# EasyEDA Pro project mt7621_integrated_router_v2.6_2025-04-17.epro, board PCB1
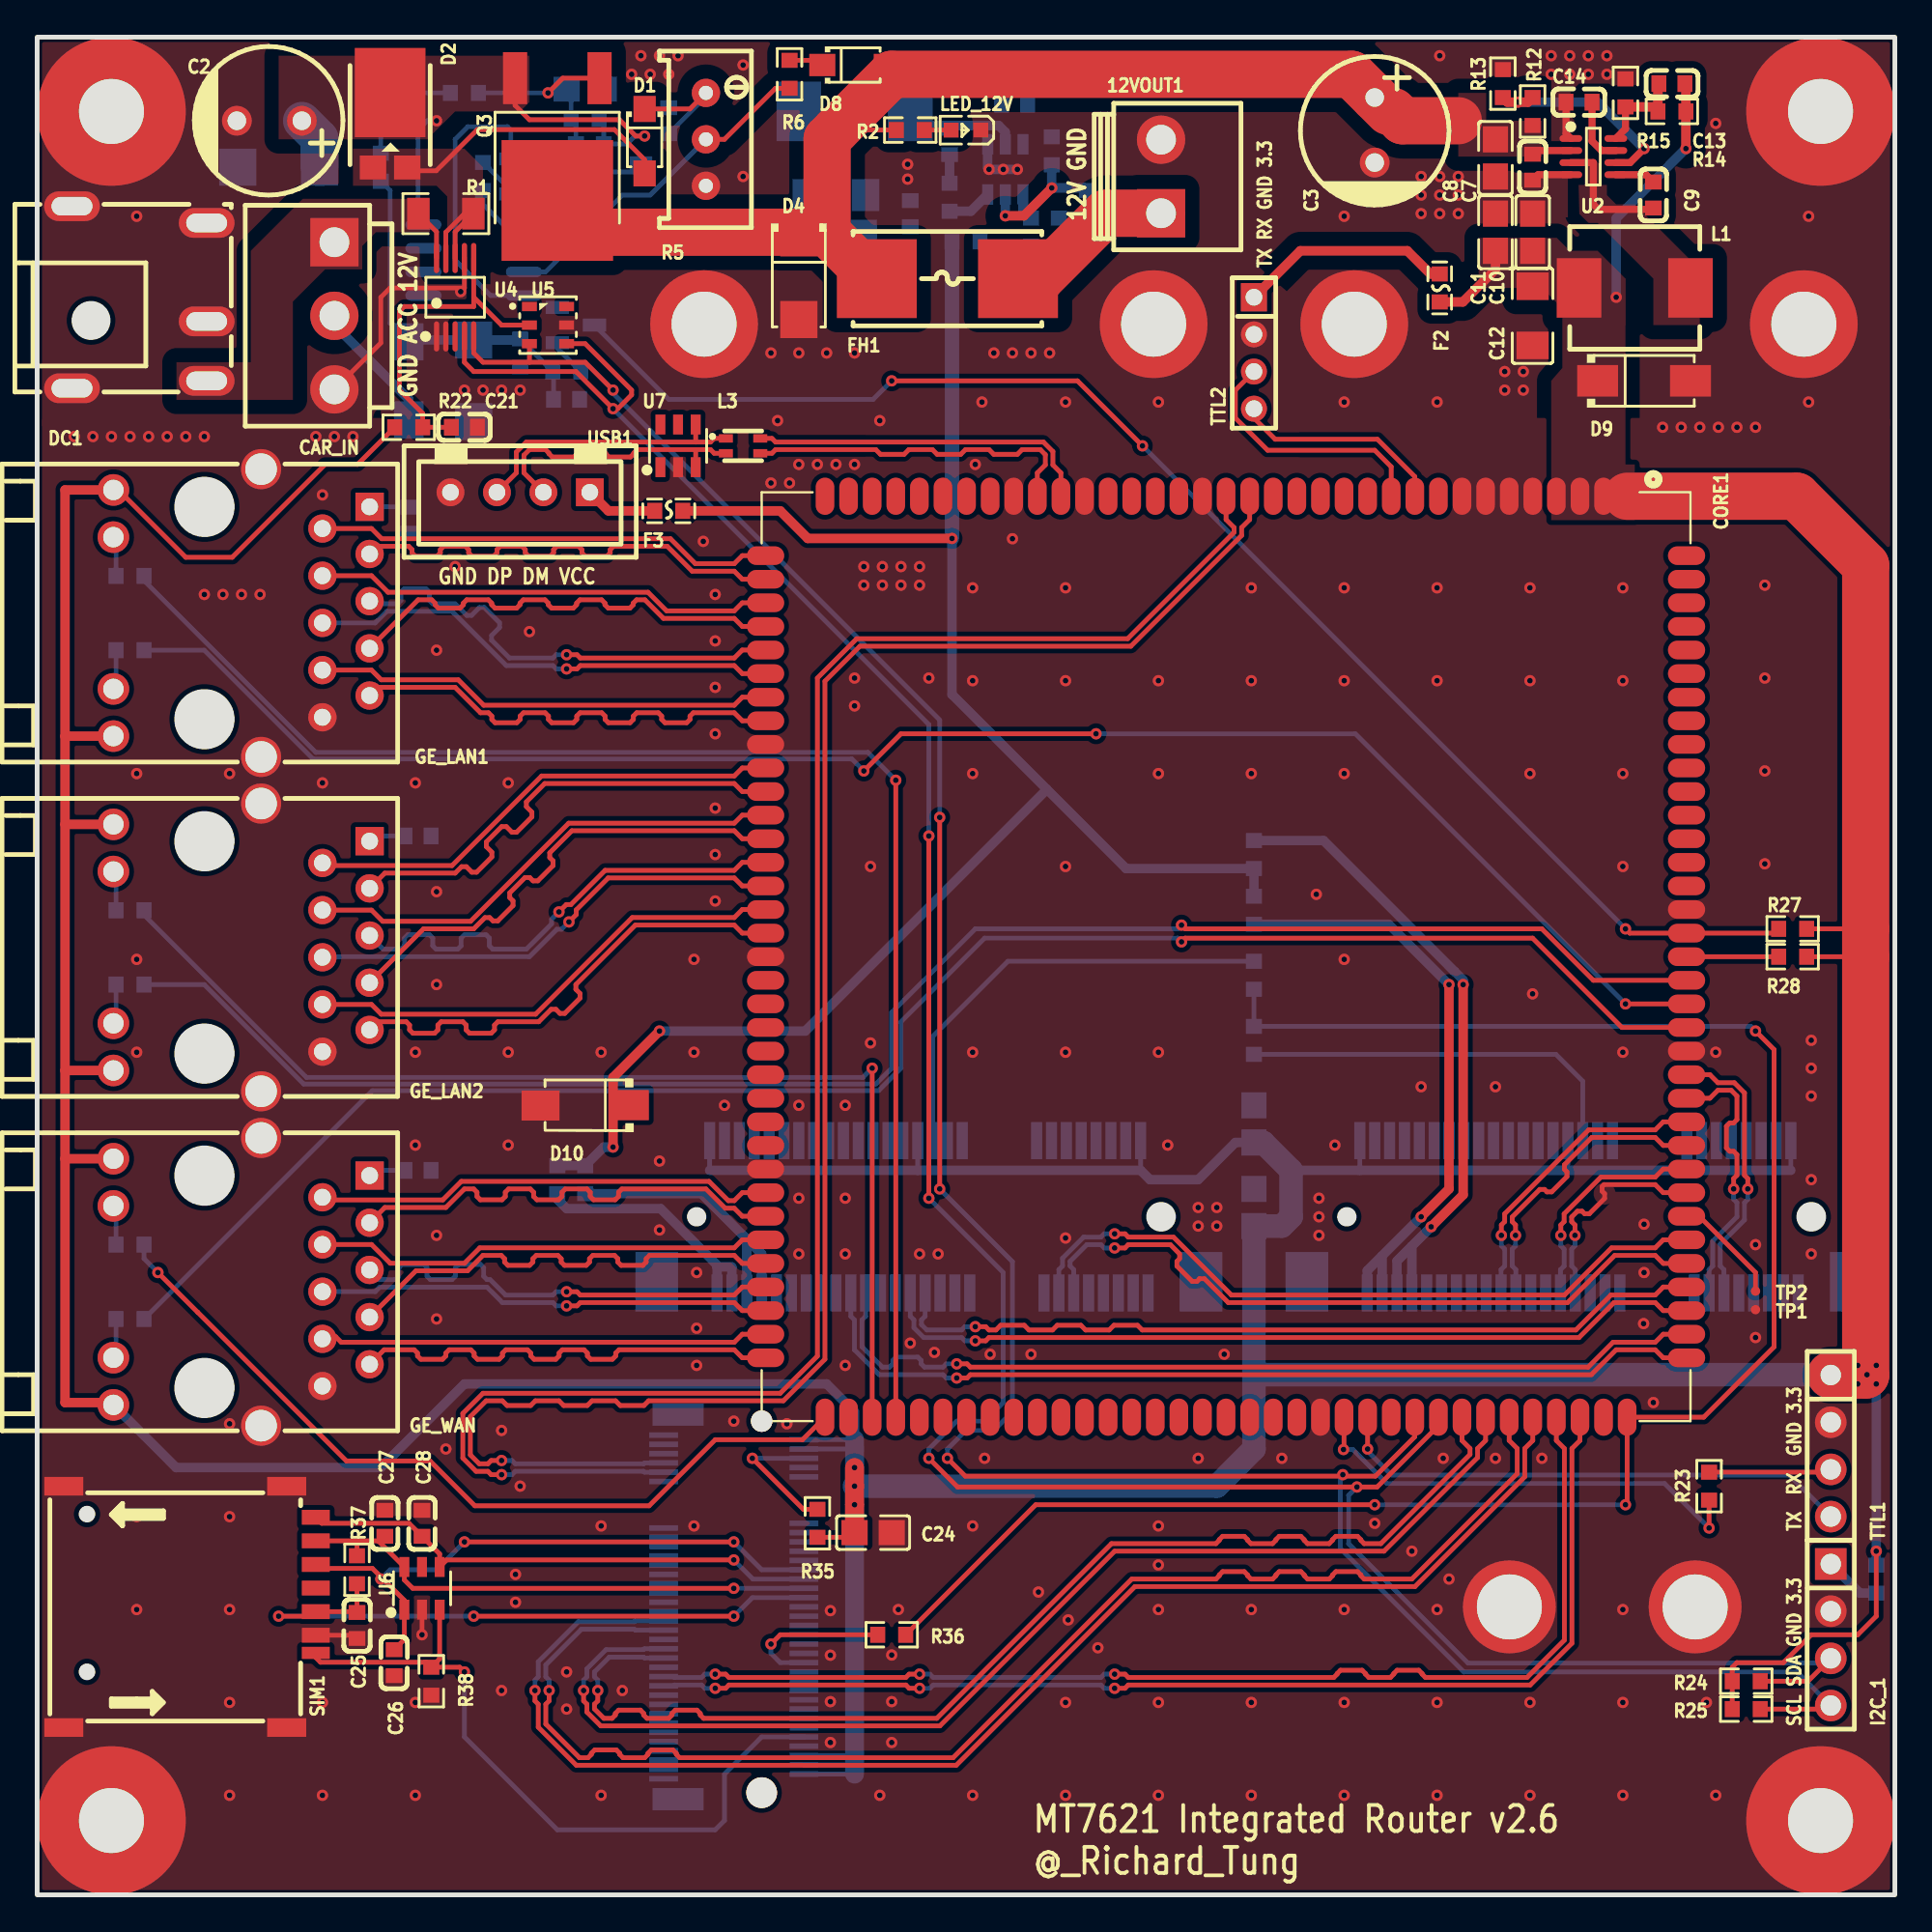
[diagram p5: board, top side]
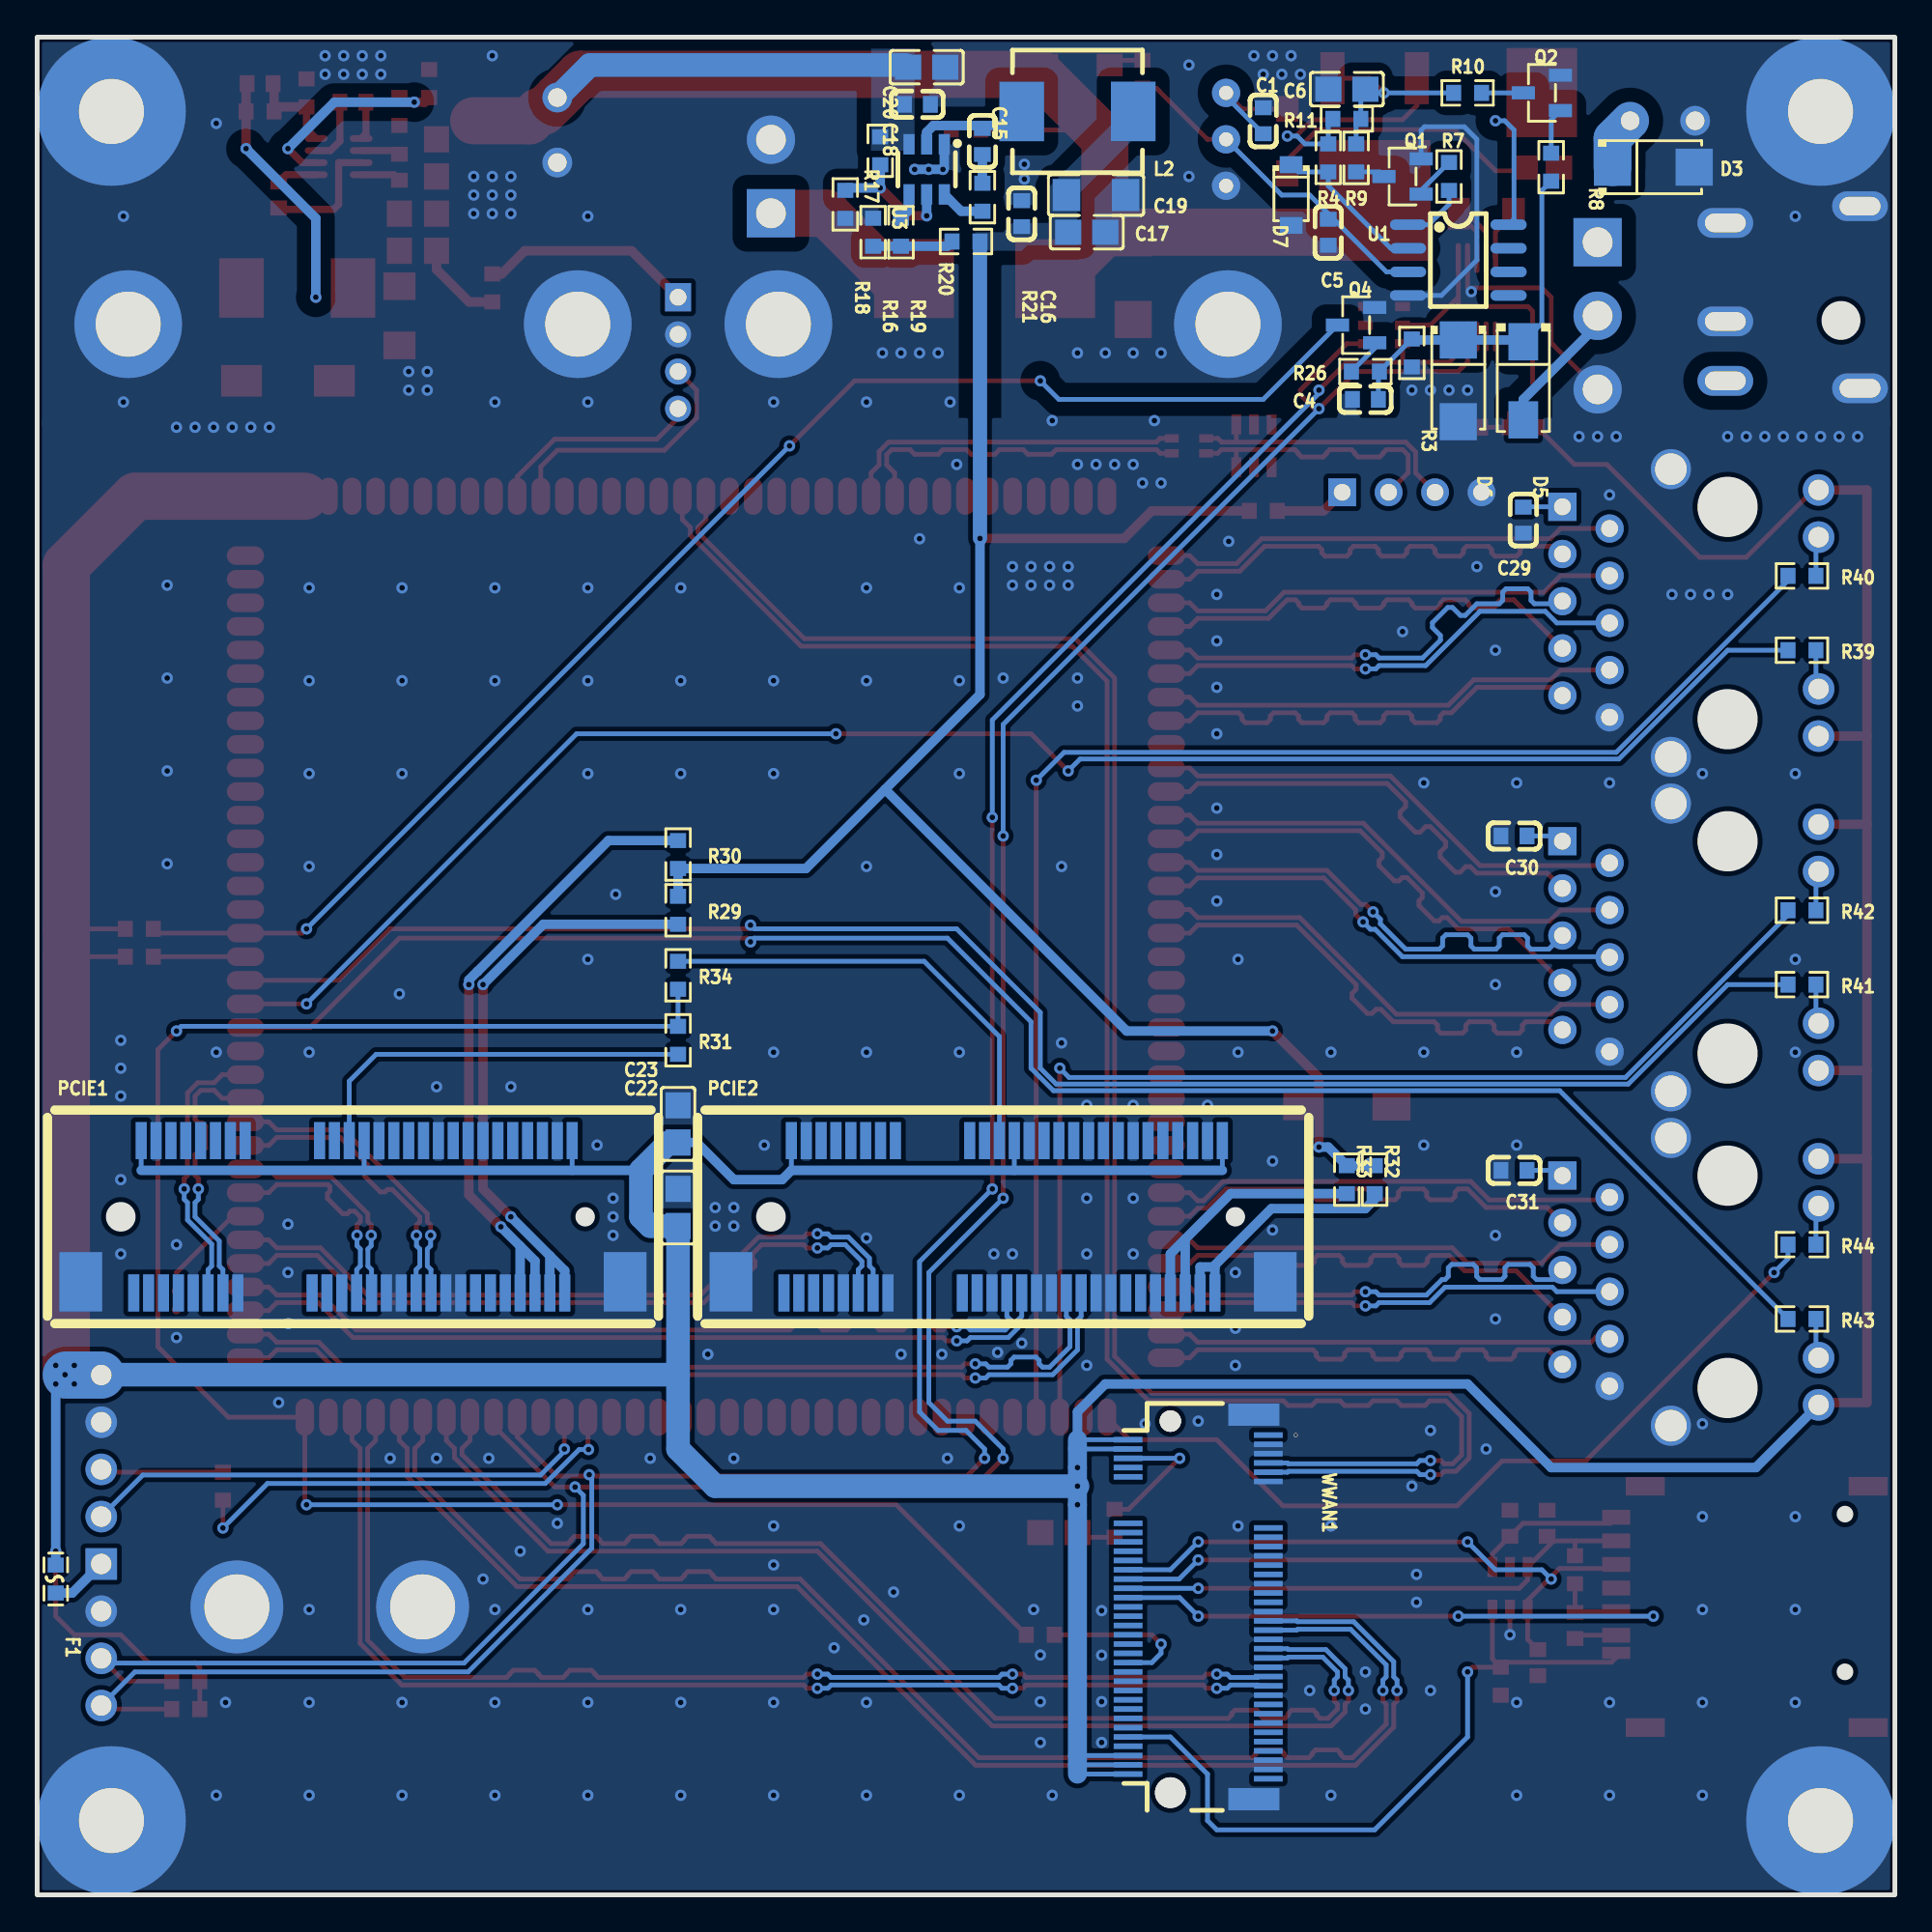
[diagram p6: board, bottom side, seen from below]

Outline 100 x 100 mm; copper layers: Top Layer, Bottom Layer. Coordinates in mm from the lower left corner of the outline.
Outline path: rectangle 0,100 100,0
Stack: Top Layer 0.035mm / Dielectric1 1.51mm FR4 er 4.5 / Bottom Layer 0.035mm

## Design rules (mm)
net USB_LTE_DP: DP1
net USB_LTE_DM: DP1
net ESW_P0_A_TXV+: ESW_P0_A_TXV
net ESW_P0_A_TXV-: ESW_P0_A_TXV
net ESW_P0_B_TXV+: ESW_P0_B_TXV
net ESW_P0_B_TXV-: ESW_P0_B_TXV
net ESW_P0_C_TXV+: ESW_P0_C_TXV
net ESW_P0_C_TXV-: ESW_P0_C_TXV
net ESW_P0_D_TXV+: ESW_P0_D_TXV
net ESW_P0_D_TXV-: ESW_P0_D_TXV
net ESW_P1_A_TXV+: ESW_P1_A_TXV
net ESW_P1_A_TXV-: ESW_P1_A_TXV
net ESW_P1_B_TXV+: ESW_P1_B_TXV
net ESW_P1_B_TXV-: ESW_P1_B_TXV
net ESW_P1_C_TXV+: ESW_P1_C_TXV
net ESW_P1_C_TXV-: ESW_P1_C_TXV
net ESW_P1_D_TXV+: ESW_P1_D_TXV
net ESW_P1_D_TXV-: ESW_P1_D_TXV
net PCIE2_TX-: PCIE2_TX
net PCIE2_TX+: PCIE2_TX
net PCIE2_RX-: PCIE2_RX
net PCIE2_RX+: PCIE2_RX
net PCIE2_REFCLK-: PCIE2_REFCLK
net PCIE2_REFCLK+: PCIE2_REFCLK
net PCIE1_TX+: PCIE1_TX
net PCIE1_TX-: PCIE1_TX
net PCIE1_RX+: PCIE1_RX
net PCIE1_RX-: PCIE1_RX
net PCIE1_REFCLK-: PCIE1_REFCLK
net PCIE1_REFCLK+: PCIE1_REFCLK
net PCIE0_RX+: PCIE0_RX
net PCIE0_RX-: PCIE0_RX
net PCIE0_TX-: PCIE0_TX
net PCIE0_TX+: PCIE0_TX
net PCIE0_REFCLK+: PCIE0_REFCLK
net PCIE0_REFCLK-: PCIE0_REFCLK
net ESW_P4_A_TXV+: ESW_P4_A_TXV
net ESW_P4_A_TXV-: ESW_P4_A_TXV
net ESW_P4_B_TXV+: ESW_P4_B_TXV
net ESW_P4_B_TXV-: ESW_P4_B_TXV
net ESW_P4_C_TXV+: ESW_P4_C_TXV
net ESW_P4_C_TXV-: ESW_P4_C_TXV
net ESW_P4_D_TXV+: ESW_P4_D_TXV
net ESW_P4_D_TXV-: ESW_P4_D_TXV
net ESW_P2_A_TXV+: ESW_P2_A_TXV
net ESW_P2_A_TXV-: ESW_P2_A_TXV
net ESW_P2_B_TXV+: ESW_P2_B_TXV
net ESW_P2_B_TXV-: ESW_P2_B_TXV
net ESW_P2_C_TXV+: ESW_P2_C_TXV
net ESW_P2_C_TXV-: ESW_P2_C_TXV
net ESW_P2_D_TXV+: ESW_P2_D_TXV
net ESW_P2_D_TXV-: ESW_P2_D_TXV
net ESW_P3_A_TXV+: ESW_P3_A_TXV
net ESW_P3_A_TXV-: ESW_P3_A_TXV
net ESW_P3_B_TXV+: ESW_P3_B_TXV
net ESW_P3_B_TXV-: ESW_P3_B_TXV
net ESW_P3_C_TXV+: ESW_P3_C_TXV
net ESW_P3_C_TXV-: ESW_P3_C_TXV
net ESW_P3_D_TXV+: ESW_P3_D_TXV
net ESW_P3_D_TXV-: ESW_P3_D_TXV
net USB3_DP: USB3_
net USB3_DM: USB3_
net USBPORT_DP: USBPORT_
net USBPORT_DM: USBPORT_
template: 自定义配置
spacing copperThickness1oz (default): track to track 0.102, other pairs 0.152 to 0.3
spacing copperThickness2oz: track to track 0.203, other pairs 0.152 to 0.3
track width copperThickness1oz (default): min 0.127, default 0.254, max 2.54
track width copperThickness2oz: min 0.203, default 0.254, max 2.54
differential pair differentialPair (default): width min 0.127, default 0.254, max 2.54; gap min 0.152, default 0.152
via viaSize (default): diameter min 0.5, default 0.61, max 10; hole min 0.3, default 0.305, max 6.299
pour e24 uses pwrcopperRegion1
pour e1172 uses pwrcopperRegion1

## Placement (name value [footprint] x y rotation side)
12VOUT1  ZX-VH3.96-2PZZ  [CONN-TH_2P-P3.96_MEGASTAR_ZX-VH3.96-2PZZ]  60.5 92.5 90 top
C1  100nF  [C0603]  34 95.5 90 bottom
C2  470uF  [CAP-TH_BD8.0-P3.50-D0.6-FD]  12.5 95.5 180 top
C3  470uF  [CAP-TH_BD8.0-P3.50-D0.6-FD]  72 95 270 top
C4  100nF  [C0603]  28.5 80.5 180 bottom
C5  100nF  [C0603]  30.5 89.5 90 bottom
C6  22uF  [C0805]  29.5 97.2 180 bottom
C7  100nF  [C0603]  80.5 93 270 top
C8  22uF  [C0805]  78.5 93.5 270 top
C9  100nF  [C0603]  87 91.5 270 top
C10  22uF  [C0805]  80.5 89.5 90 top
C11  22uF  [C0805]  78.5 89.5 90 top
C12  100uF  [C1206]  80.5 85 270 top
C13  33pF  [C0603]  88 97.5 180 top
C14  100nF  [C0603]  83 96.5 0 top
C15  1uF  [C0603]  49.12 94.38 270 bottom
C16  100nF  [C0603]  47 90.5 90 bottom
C17  22uF  [C0805]  43.5 89.5 0 bottom
C18  100nF  [C0603]  52.62 96.38 180 bottom
C19  100uF  [C1206]  43 91.5 180 bottom
C20  22uF  [C0805]  52.12 98.38 180 bottom
C21  100nF  [C0603]  23 79 0 top
C22  22uF  [C0805]  65.5 37 90 bottom
C23  22uF  [C0805]  65.5 41.5 90 bottom
C24  22uF  [C0805]  45 19.5 0 top
C25  100nF  [C0603]  17.22 14.5 270 top
C26  33pF  [C0603]  19.22 12.5 90 top
C27  33pF  [C0603]  18.72 20 90 top
C28  33pF  [C0603]  20.72 20 90 top
C29  1nF  [C0603]  20 74 270 bottom
C30  1nF  [C0603]  20.5 57 0 bottom
C31  1nF  [C0603]  20.5 39 0 bottom
CAR_IN  ZX-VH3.96-3PZZ  [CONN-TH_3P-P3.96_MEGASTAR_ZX-VH3.96-3PZZ]  16 85 270 top
CORE1  HLK-7621  [COMM-SMD_HLK-7621]  64 50.5 270 top
D1  1N4001W  [SOD-123FL_L2.7-W1.8-LS3.8-RD]  32.7 94.4 270 top
D2  ST2045  [TO-277_3P-L5.4-W4.0-LS6.5-BR]  19 95 270 top
D3  SMAJ15A  [SMA_L4.3-W2.6-LS5.2-RD]  13 93 180 bottom
D4  SMAJ15A  [SMA_L4.3-W2.6-LS5.2-RD]  41 87 270 top
D5  1N4001  [SMA_L4.3-W2.5-LS5.0-RD]  20 81.5 270 bottom
D6  SMAJ15A  [SMA_L4.3-W2.6-LS5.2-RD]  23.5 81.5 270 bottom
D7  MMSZ5232BT1G  [SOD-123_L2.7-W1.6-LS3.7-RD]  32.5 91.5 270 bottom
D8  1N4001W  [SOD-123FL_L2.7-W1.8-LS3.8-RD]  44 98.5 0 top
D9  SMAJ3.3A  [SMA-SMD_L4.4-W2.7-LS5.4-RD]  86.5 81.5 0 top
D10  SMAJ5.0A  [SMA_L4.3-W2.6-LS5.0-RD]  29.5 42.5 180 top
DC1  -  [DC-IN-TH_DC-044A-20A]  5.5 86 0 top
F1  BSMD0603-075-6V  [F0603]  99 17 270 bottom
F2  BSMD0603-075-6V  [F0603]  75.5 86.5 90 top
F3  BSMD0603-075-6V  [F0603]  34 74.5 180 top
FH1  01550900M  [FUSE-SMD_L9.8-W5.0]  49 87 180 top
GE_LAN1  HR911130A  [RJ45-TH_HR911130A]  11 69 90 top
GE_LAN2  HR911130A  [RJ45-TH_HR911130A]  11 51 90 top
GE_WAN  HR911130A  [RJ45-TH_HR911130A]  11 33 90 top
I2C_1  PZ254V-11-04P  [HDR-TH_4P-P2.54-V-M]  96.55 14 270 top
L1  3.3uH  [IND-SMD_L7.0-W6.6]  86 86.5 180 top
L2  6.8uH  [IND-SMD_L7.0-W6.6]  44 96 180 bottom
L3  ACM2012-900-2P-T001  [FILTER-SMD_4P-L2.0-W1.2-TL_ACM2012E]  38 78 0 top
LED_12V  XL-1608SYGC-06  [LED0603-RD_GREEN]  50 95 180 top
NOREF  -  [Pad_e1560]  4 96 90 top
NOREF#2  -  [Pad_e29]  4 4 90 top
NOREF#3  -  [Pad_e28]  96 4 90 top
NOREF#4  -  [Pad_e27]  96 96 90 top
PCIE1  Mini-PCI-E_Socket_5V  [Mini_PCI-E_Socket]  95.5 36.5 180 bottom
PCIE2  Mini-PCI-E_Socket_5V  [Mini_PCI-E_Socket]  60.5 36.5 180 bottom
Q1  S9013-E  [SOT-23-3_L2.9-W1.3-P1.90-LS2.4-BR]  26.5 92.5 180 bottom
Q2  S9013-E  [SOT-23-3_L2.9-W1.3-P1.90-LS2.4-BR]  19 97 180 bottom
Q3  AOD409-HXY  [TO-252-2_L6.6-W6.1-P4.57-LS9.9-TL-CW]  28 94.5 270 top
Q4  S9013-E  [SOT-23-3_L2.9-W1.3-P1.90-LS2.4-BR]  29 84.5 180 bottom
R1  10mΩ  [R1206]  22 90.5 180 top
R2  10kΩ  [R0603]  47 95 0 top
R3  100kΩ  [R0603]  26 83 90 bottom
R4  4.7kΩ  [R0603]  30.5 93.5 270 bottom
R5  10kΩ  [RES-ADJ-TH_3P-L10.0-W10.0-P2.50-L]  36 94.5 270 top
R6  51kΩ  [R0603]  40.5 98 90 top
R7  4.7kΩ  [R0603]  24 92.5 90 bottom
R8  4.7kΩ  [R0603]  18.5 93 90 bottom
R9  0Ω  [R0603]  29 93.5 270 bottom
R10  0Ω  [R0603]  23 97 0 bottom
R11  100kΩ  [R0603]  29.5 95.6 180 bottom
R12  100kΩ  [R0603]  80.5 96 270 top
R13  18kΩ  [R0603]  78.9 97.5 90 top
R14  40.2kΩ  [R0603]  88 96 180 top
R15  8.87kΩ  [R0603]  85.5 97 270 top
R16  7.68kΩ  [R0603]  55 89.5 270 bottom
R17  100kΩ  [R0603]  54.62 93.88 270 bottom
R18  18kΩ  [R0603]  56.5 91 90 bottom
R19  24.9kΩ  [R0603]  53.5 89.5 90 bottom
R20  40.2kΩ  [R0603]  50 89 180 bottom
R21  0Ω  [R0603]  49.12 91.38 270 bottom
R22  0Ω  [R0603]  20 79 180 top
R23  4.7kΩ  [R0603]  90 22 90 top
R24  4.7kΩ  [R0603]  92 11.5 180 top
R25  4.7kΩ  [R0603]  92 10 180 top
R26  10kΩ  [R0603]  28.5 82 0 bottom
R27  10kΩ  [R0603]  94.5 52 0 top
R28  10kΩ  [R0603]  94.5 50.5 0 top
R29  0Ω  [R0603]  65.5 53 270 bottom
R30  0Ω  [R0603]  65.5 56 90 bottom
R31  0Ω  [R0603]  65.5 46 90 bottom
R32  0Ω  [R0603]  28 38.5 270 bottom
R33  0Ω  [R0603]  29.5 38.5 270 bottom
R34  0Ω  [R0603]  65.5 49.5 270 bottom
R35  10kΩ  [R0603]  42 20 90 top
R36  0Ω  [R0603]  46 14 0 top
R37  15kΩ  [R0603]  17.22 17.5 270 top
R38  not install  [R0603]  21.22 11.5 270 top
R39  1kΩ  [R0603]  5 67 0 bottom
R40  1kΩ  [R0603]  5 71 0 bottom
R41  1kΩ  [R0603]  5 49 0 bottom
R42  1kΩ  [R0603]  5 53 0 bottom
R43  1kΩ  [R0603]  5 31 180 bottom
R44  1kΩ  [R0603]  5 35 0 bottom
SIM1  SNO-1350  [SIM-SMD_SNO-1350]  8.22 15.5 270 top
TP1  -  [Test-Point-0.5mm]  92.5 31.5 0 top
TP2  -  [Test-Point-0.5mm]  92.5 32.5 0 top
TTL1  PZ254V-11-04P  [HDR-TH_4P-P2.54-V-M]  96.55 24.17 270 top
TTL2  HX PZ2.0-1x4P ZZ  [HDR-TH_4P-P2.00-V-M-3]  65.5 83 270 top
U1  LM358DT  [SOIC-8_L5.0-W4.0-P1.27-LS6.0-BL]  23.5 88 270 bottom
U2  MP2225GJ-Z  [TSOT-23-8_L2.9-W1.6-P0.65-LS2.8-BR]  83.77 93.57 180 top
U3  MT1471  [SOT-23-6_L2.9-W1.6-P0.95-LS2.8-BR]  52.12 92.88 90 bottom
U4  INA226AIDGSR  [MSOP-10_L3.0-W3.0-P0.50-LS5.0-BL]  22.5 86 0 top
U5  AHT20  [SENSOR-SMD_L3.0-W3.0-P1.00-BR]  27.5 84.5 180 top
U6  USBLC6-4SC6  [SOT-23-6_L2.9-W1.6-P0.95-LS2.8-BL]  20.72 16.5 0 top
U7  USBLC6-4SC6  [SOT-23-6_L2.9-W1.6-P0.95-LS2.8-BL]  34.5 78 0 top
USB1  BX-XH2.54-4PZZ  [CONN-TH_4P-P2.50_BX-XH2.54-4PZZ]  26 75.5 180 top
WWAN1  -  [NGFF_B_KEY_H3.2]  39 15.5 270 bottom

## Footprints (pads in the part's own frame, mm; a bottom-side part is the same pattern mirrored in y, then rotated)
C0603
  rect 0.8x0.9 smd: 1(-0.7,0) 2(0.7,0)
C0805
  rect 1.41x1.35 smd: 1(-1,0) 2(1,0)
C1206
  rect 1.485x1.728 smd: 1(-1.593,0) 2(1.593,0)
CAP-TH_BD8.0-P3.50-D0.6-FD
  round 1.6 hole 1: 1(-1.75,0) 2(1.75,0)
COMM-SMD_HLK-7621
  oval 2x1 smd: 1(-24.788,21.59) 2(-24.788,20.32) 3(-24.788,19.05) 4(-24.788,17.78) 5(-24.788,16.51) 6(-24.788,15.24) 7(-24.788,13.97) 8(-24.788,12.7) 9(-24.788,11.43) 10(-24.788,10.16) 11(-24.788,8.89) 12(-24.788,7.62) 13(-24.788,6.35) 14(-24.788,5.08) 15(-24.788,3.81) 16(-24.788,2.54) 17(-24.788,1.27) 18(-24.788,0) 19(-24.788,-1.27) 20(-24.788,-2.54) 21(-24.788,-3.81) 22(-24.788,-5.08) 23(-24.788,-6.35) 24(-24.788,-7.62) 25(-24.788,-8.89) 26(-24.788,-10.16) 27(-24.788,-11.43) 28(-24.788,-12.7) 29(-24.788,-13.97) 30(-24.788,-15.24) 31(-24.788,-16.51) 32(-24.788,-17.78) 33(-24.788,-19.05) 34(-24.788,-20.32) 35(-24.788,-21.59) 71(24.788,-21.59) 72(24.788,-20.32) 73(24.788,-19.05) 74(24.788,-17.78) 75(24.788,-16.51) 76(24.788,-15.24) 77(24.788,-13.97) 78(24.788,-12.7) 79(24.788,-11.43) 80(24.788,-10.16) 81(24.788,-8.89) 82(24.788,-7.62) 83(24.788,-6.35) 84(24.788,-5.08) 85(24.788,-3.81) 86(24.788,-2.54) 87(24.788,-1.27) 88(24.788,0) 89(24.788,1.27) 90(24.788,2.54) 91(24.788,3.81) 92(24.788,5.08) 93(24.788,6.35) 94(24.788,7.62) 95(24.788,8.89) 96(24.788,10.16) 97(24.788,11.43) 98(24.788,12.7) 99(24.788,13.97) 100(24.788,15.24) 101(24.788,16.51) 102(24.788,17.78) 103(24.788,19.05) 104(24.788,20.32) 105(24.788,21.59)
  oval 1x2 smd: 36(-21.59,-24.788) 37(-20.32,-24.788) 38(-19.05,-24.788) 39(-17.78,-24.788) 40(-16.51,-24.788) 41(-15.24,-24.788) 42(-13.97,-24.788) 43(-12.7,-24.788) 44(-11.43,-24.788) 45(-10.16,-24.788) 46(-8.89,-24.788) 47(-7.62,-24.788) 48(-6.35,-24.788) 49(-5.08,-24.788) 50(-3.81,-24.788) 51(-2.54,-24.788) 52(-1.27,-24.788) 53(0,-24.788) 54(1.27,-24.788) 55(2.54,-24.788) 56(3.81,-24.788) 57(5.08,-24.788) 58(6.35,-24.788) 59(7.62,-24.788) 60(8.89,-24.788) 61(10.16,-24.788) 62(11.43,-24.788) 63(12.7,-24.788) 64(13.97,-24.788) 65(15.24,-24.788) 66(16.51,-24.788) 67(17.78,-24.788) 68(19.05,-24.788) 69(20.32,-24.788) 70(21.59,-24.788) 106(21.59,24.788) 107(20.32,24.788) 108(19.05,24.788) 109(17.78,24.788) 110(16.51,24.788) 111(15.24,24.788) 112(13.97,24.788) 113(12.7,24.788) 114(11.43,24.788) 115(10.16,24.788) 116(8.89,24.788) 117(7.62,24.788) 118(6.35,24.788) 119(5.08,24.788) 120(3.81,24.788) 121(2.54,24.788) 122(1.27,24.788) 123(0,24.788) 124(-1.27,24.788) 125(-2.54,24.788) 126(-3.81,24.788) 127(-5.08,24.788) 128(-6.35,24.788) 129(-7.62,24.788) 130(-8.89,24.788) 131(-10.16,24.788) 132(-11.43,24.788) 133(-12.7,24.788) 134(-13.97,24.788) 135(-15.24,24.788) 136(-16.51,24.788) 137(-17.78,24.788) 138(-19.05,24.788) 139(-20.32,24.788) 140(-21.59,24.788)
CONN-TH_2P-P3.96_MEGASTAR_ZX-VH3.96-2PZZ
  rect 2.6x2.6 hole 1.6: 1(-1.98,0)
  round 2.6 hole 1.6: 2(1.98,0)
CONN-TH_3P-P3.96_MEGASTAR_ZX-VH3.96-3PZZ
  rect 2.6x2.6 hole 1.6: 1(-3.96,0)
  round 2.6 hole 1.6: 2(0,0) 3(3.96,0)
CONN-TH_4P-P2.50_BX-XH2.54-4PZZ
  rect 1.5x1.5 hole 0.9: 1(-3.75,0)
  round 1.5 hole 0.9: 2(-1.25,0) 3(1.25,0) 4(3.75,0)
DC-IN-TH_DC-044A-20A
  oval 3x1.6 hole 2.2x1: 1(3.625,-4.5) 2(3.625,4.001) 3(3.625,-1.3) 4(-3.625,-4.9) 5(-3.625,4.9)
F0603
  rect 0.806x0.864 smd: 1(-0.753,0) 2(0.753,0)
FILTER-SMD_4P-L2.0-W1.2-TL_ACM2012E
  rect 0.75x0.448 smd: 1(-0.925,0.4) 2(-0.925,-0.4) 3(0.925,-0.4) 4(0.925,0.4)
FUSE-SMD_L9.8-W5.0
  rect 4.3x4.24 smd: 1(-3.8,0) 2(3.8,0)
HDR-TH_4P-P2.00-V-M-3
  rect 1.524x1.4 hole 0.9: 1(-3,0)
  round 1.4 hole 0.9: 2(-1,0) 3(1,0) 4(3,0)
HDR-TH_4P-P2.54-V-M
  rect 1.7x1.7 hole 1.1: 1(-3.81,0)
  round 1.7 hole 1.1: 2(-1.27,0) 3(1.27,0) 4(3.81,0)
IND-SMD_L7.0-W6.6
  rect 2.4x3.2 smd: 1(-3,0) 2(3,0)
LED0603-RD_GREEN
  rect 0.8x0.8 smd: 1(-0.799,-0.004) 2(0.799,0.004)
Mini_PCI-E_Socket
  rect 0.6x2 smd: 1(0.7,-4.1) 2(1.1,4.1) 3(1.5,-4.1) 4(1.9,4.1) 5(2.3,-4.1) 6(2.7,4.1) 7(3.1,-4.1) 8(3.5,4.1) 9(3.9,-4.1) 10(4.3,4.1) 11(4.7,-4.1) 12(5.1,4.1) 13(5.5,-4.1) 14(5.9,4.1) 15(6.3,-4.1) 16(6.7,4.1) 17(10.3,-4.1) 18(10.7,4.1) 19(11.1,-4.1) 20(11.5,4.1) 21(11.9,-4.1) 22(12.3,4.1) 23(12.7,-4.1) 24(13.1,4.1) 25(13.5,-4.1) 26(13.9,4.1) 27(14.3,-4.1) 28(14.7,4.1) 29(15.1,-4.1) 30(15.5,4.1) 31(15.9,-4.1) 32(16.3,4.1) 33(16.7,-4.1) 34(17.1,4.1) 35(17.5,-4.1) 36(17.9,4.1) 37(18.3,-4.1) 38(18.7,4.1) 39(19.1,-4.1) 40(19.5,4.1) 41(19.9,-4.1) 42(20.3,4.1) 43(20.7,-4.1) 44(21.1,4.1) 45(21.5,-4.1) 46(21.9,4.1) 47(22.3,-4.1) 48(22.7,4.1) 49(23.1,-4.1) 50(23.5,4.1) 51(23.9,-4.1) 52(24.3,4.1)
  rect 2.3x3.2 smd: S(-2.15,-3.5) S(27.15,-3.5)
  round 5.8 hole 3.5: S(0.4,48.05) S(24.6,48.05)
MSOP-10_L3.0-W3.0-P0.50-LS5.0-BL
  oval 0.28x1.62 smd: 1(-1,-2.11) 2(-0.5,-2.11) 3(0,-2.11) 4(0.5,-2.11) 5(1,-2.11) 6(1,2.11) 7(0.5,2.11) 8(0,2.11) 9(-0.5,2.11) 10(-1,2.11)
NGFF_B_KEY_H3.2
  rect 0.3x1.55 smd: 1(-9.25,5.275) 2(-9,-2.275) 3(-8.75,5.275) 4(-8.5,-2.275) 5(-8.25,5.275) 6(-8,-2.275) 7(-7.75,5.275) 8(-7.5,-2.275) 9(-7.25,5.275) 10(-7,-2.275) 11(-6.75,5.275) 20(-4.5,-2.275) 21(-4.25,5.275) 22(-4,-2.275) 23(-3.75,5.275) 24(-3.5,-2.275) 25(-3.25,5.275) 26(-3,-2.275) 27(-2.75,5.275) 28(-2.5,-2.275) 29(-2.25,5.275) 30(-2,-2.275) 31(-1.75,5.275) 32(-1.5,-2.275) 33(-1.25,5.275) 34(-1,-2.275) 35(-0.75,5.275) 36(-0.5,-2.275) 37(-0.25,5.275) 38(0,-2.275) 39(0.25,5.275) 40(0.5,-2.275) 41(0.75,5.275) 42(1,-2.275) 43(1.25,5.275) 44(1.5,-2.275) 45(1.75,5.275) 46(2,-2.275) 47(2.25,5.275) 48(2.5,-2.275) 49(2.75,5.275) 50(3,-2.275) 51(3.25,5.275) 52(3.5,-2.275) 53(3.75,5.275) 54(4,-2.275) 55(4.25,5.275) 56(4.5,-2.275) 57(4.75,5.275) 58(5,-2.275) 59(5.25,5.275) 60(5.5,-2.275) 61(5.75,5.275) 62(6,-2.275) 63(6.25,5.275) 64(6.5,-2.275) 65(6.75,5.275) 66(7,-2.275) 67(7.25,5.275) 68(7.5,-2.275) 69(7.75,5.275) 70(8,-2.275) 71(8.25,5.275) 72(8.5,-2.275) 73(8.75,5.275) 74(9,-2.275) 75(9.25,5.275)
  round 1.15 hole 1.15: 76(-10,0)
  round 1.65 hole 1.65: 77(10,0)
  rect 1.2x2.75 smd: S(-10.35,4.5) S(10.35,4.5)
  round 5 hole 3.5: S(0,-50.25) S(0,-40.25)
Pad_e27
  round 8 hole 3.5: 1(0,0)
Pad_e28
  round 8 hole 3.5: 1(0,0)
Pad_e29
  round 8 hole 3.5: 1(0,0)
Pad_e1560
  round 8 hole 3.5: 1(0,0)
R0603
  rect 0.806x0.864 smd: 1(-0.753,0) 2(0.753,0)
R1206
  rect 1.208x1.701 smd: 1(-1.479,0) 2(1.479,0)
RES-ADJ-TH_3P-L10.0-W10.0-P2.50-L
  round 1.524 hole 0.762: 1(-2.5,0) 2(0,0) 3(2.5,0)
RJ45-TH_HR911130A
  round 1.7 hole 1.1: 11(6.625,6.895) 12(4.085,6.895) 13(-4.085,6.895) 14(-6.625,6.895)
  rect 1.524x1.524 hole 0.91: P1(5.72,-6.895)
  round 1.524 hole 0.91: P2(4.549,-4.355) P3(3.18,-6.895) P4(2.009,-4.355) P5(0.64,-6.895) P6(-0.531,-4.355) P7(-1.9,-6.895) P8(-3.071,-4.355) P9(-4.44,-6.895) P10(-5.611,-4.355)
  round 2.159 hole 1.7: SHIELD0(-7.745,-1.056) SHIELD1(7.745,-1.056)
SENSOR-SMD_L3.0-W3.0-P1.00-BR
  rect 0.8x0.5 smd: 1(1,-1) 2(1,0) 3(1,1) 4(-1,1) 5(-1,0) 6(-1,-1)
SIM-SMD_SNO-1350
  rect 1x2.1 smd: 8(6.495,5.218) 9(6.495,-6.782) 10(-6.495,-6.782) 11(-6.495,5.218)
  rect 0.8x1.5 smd: C1(0.255,6.782) C2(-2.285,6.782) C3(-4.825,6.782) C5(1.525,6.782) C6(-1.015,6.782) C7(-3.555,6.782)
  rect 0.65x1.5 smd: CD(2.475,6.782)
SMA-SMD_L4.4-W2.7-LS5.4-RD
  rect 2.2x1.7 smd: 1(-2.5,0) 2(2.5,0)
SMA_L4.3-W2.5-LS5.0-RD
  rect 2x1.593 smd: 1(-2.1,0) 2(2.1,0)
SMA_L4.3-W2.6-LS5.0-RD
  rect 2.046x1.62 smd: 1(-2.404,-0.009) 2(2.404,0.009)
SMA_L4.3-W2.6-LS5.2-RD
  rect 2x2 smd: 1(-2.2,0) 2(2.2,0)
SOD-123_L2.7-W1.6-LS3.7-RD
  rect 0.91x1.22 smd: 1(-1.635,0) 2(1.635,0)
SOD-123FL_L2.7-W1.8-LS3.8-RD
  rect 1.4x1.2 smd: 1(-1.735,0) 2(1.735,0)
SOIC-8_L5.0-W4.0-P1.27-LS6.0-BL
  oval 0.569x1.95 smd: 1(-1.905,-2.705) 2(-0.635,-2.705) 3(0.635,-2.705) 4(1.905,-2.705) 5(1.905,2.705) 6(0.635,2.705) 7(-0.635,2.705) 8(-1.905,2.705)
SOT-23-3_L2.9-W1.3-P1.90-LS2.4-BR
  rect 1.25x0.7 smd: 1(1,-0.95) 2(1,0.95) 3(-1,0)
SOT-23-6_L2.9-W1.6-P0.95-LS2.8-BL
  rect 0.532x1.072 smd: 1(-0.95,-1.149) 2(0,-1.149) 3(0.95,-1.149) 4(0.95,1.149) 5(0,1.149) 6(-0.95,1.149)
SOT-23-6_L2.9-W1.6-P0.95-LS2.8-BR
  rect 1.1x0.6 smd: 1(1.35,-0.95) 2(1.35,0) 3(1.35,0.95) 4(-1.35,0.95) 5(-1.35,0) 6(-1.35,-0.95)
Test-Point-0.5mm
  round 0.5 smd: 1(0,0)
TO-252-2_L6.6-W6.1-P4.57-LS9.9-TL-CW
  rect 2.8x1.3 smd: 1(-3.292,2.273) 3(-3.292,-2.273)
  rect 6.5x6 smd: 2(3.292,0)
TO-277_3P-L5.4-W4.0-LS6.5-BR
  rect 1.29x1.423 smd: 1(2.017,-0.92) 3(2.017,0.92)
  rect 4.8x3.8 smd: 2(-2.017,0)
TSOT-23-8_L2.9-W1.6-P0.65-LS2.8-BR
  oval 1.222x0.364 smd: 1(1.211,-0.975) 2(1.211,-0.325) 3(1.211,0.325) 4(1.211,0.975) 5(-1.211,0.975) 6(-1.211,0.325) 7(-1.211,-0.325) 8(-1.211,-0.975)

## Nets
As in the schematic, except:
GND: 12VOUT1.2 C1.2 C2.2 C3.2 C4.1 C5.1 C6.1 C7.2 C8.2 C10.2 C11.2 C12.2 C14.1 C16.2 C17.1 C18.2 C19.2 C20.2 C21.2 C22.2 C23.2 C24.2 C25.2 C26.1 C27.2 C28.2 C29.2 C30.2 C31.2 CAR_IN.3 CORE1.5 CORE1.6 CORE1.7 CORE1.8 CORE1.19 CORE1.24 CORE1.27 CORE1.44 CORE1.53 CORE1.62 CORE1.92 CORE1.119 CORE1.125 D3.2 D4.2 D6.2 D7.2 D9.2 D10.2 DC1.2 DC1.3 DC1.4 DC1.5 GE_LAN1.P10 GE_LAN1.SHIELD0 GE_LAN1.SHIELD1 GE_LAN2.P10 GE_LAN2.SHIELD0 GE_LAN2.SHIELD1 GE_WAN.P10 GE_WAN.SHIELD0 GE_WAN.SHIELD1 I2C_1.2 LED_12V.1 NOREF.1 NOREF#2.1 NOREF#3.1 NOREF#4.1 PCIE1.4 PCIE1.9 PCIE1.15 PCIE1.21 PCIE1.26 PCIE1.27 PCIE1.29 PCIE1.34 PCIE1.35 PCIE1.37 PCIE1.40 PCIE1.43 PCIE1.50 PCIE1.S PCIE2.4 PCIE2.9 PCIE2.15 PCIE2.21 PCIE2.26 PCIE2.27 PCIE2.29 PCIE2.34 PCIE2.35 PCIE2.37 PCIE2.40 PCIE2.43 PCIE2.50 PCIE2.S Q1.2 Q2.2 Q4.2 R3.1 R5.3 R13.2 R15.1 R16.1 R18.1 R38.2 SIM1.8 SIM1.9 SIM1.10 SIM1.11 SIM1.C5 TP1.1 TTL1.2 TTL2.2 U1.4 U2.1 U2.4 U3.1 U4.1 U4.2 U4.7 U5.5 U6.2 U7.2 USB1.4 WWAN1.3 WWAN1.5 WWAN1.11 WWAN1.27 WWAN1.33 WWAN1.39 WWAN1.45 WWAN1.51 WWAN1.57 WWAN1.71 WWAN1.73 WWAN1.S

Pads without a net: CORE1 9 14 15 16 76 77 78 79 80 81 82 83 84 85 86 87 88 89 90 91 95 104 126 127 128 129 130 131 132 133 134 135 136 137 138 139 140; PCIE1 1 3 5 6 7 8 10 12 14 16 17 18 19 20 28 30 32 36 38 39 41 42 46 48; PCIE2 1 3 5 6 7 8 10 12 14 16 17 18 19 20 28 30 32 36 38 39 41 42 46 48; SIM1 C6; U1 5 6 7; U4 3; U5 1 6; U6 5; U7 1 5 6; WWAN1 1 8 20 21 22 23 24 25 26 28 29 31 35 37 38 40 42 44 46 48 52 54 56 58 59 60 61 62 63 64 65 67 68 69 75 76 77

## Via types
v1: diameter 0.61, hole 0.305, Top Layer to Bottom Layer, 376 vias

## Routing (per net, layer and track width the routed paths; a pad name or vN(x,y) marks a point on that pad's centre or on a via; arc(x,y) is an arc through that point)
3.3V: length 418
  Top Layer w0.254: 95.25,50.5 98.43,50.5 ; v1(99,18.5) 99,15 98,14 95.5,14 94,12.5 91.5,12.5 91.25,12.25 R24.2 R25.2 ; 42,19.25 43.75,19.25 C24.1 ; 95.25,52 98.43,52 ; GE_LAN1.11 4.38,75.62 8,72 10.5,72 15.5,77 17.25,77 R22.2
  Top Layer w0.508: GE_LAN2.11 1.5,57.62 ; 1.5,57.62 1.5,62.38 ; 1.5,57.62 1.5,44.38 ; GE_WAN.11 1.5,39.62 ; 1.5,39.62 1.5,44.38 ; 1.5,39.62 1.5,26.5 3.98,26.5 GE_WAN.14 ; GE_LAN1.11 1.5,75.62 1.5,62.38 ; 1.5,62.38 GE_LAN1.14 ; F2.1 76.75,85.75 78.5,87.5 C11.1 ; 1.5,44.38 GE_LAN2.14 ; v1(88.75,94) 88.75,97.5
  Top Layer w1.016: v1(44,23) v1(44,22) v1(44,21) C24.1
  Top Layer w2.54: CORE1.1 94.71,75.29 98.43,71.57 98.43,27.98 TTL1.1
  Bottom Layer w0.254: 44,6.5 WWAN1.74 ; v1(98.5,28) v1(98,27.5) ; PCIE1.24 82.4,39 ; WWAN1.2 44,24.5 ; PCIE1.2 94.4,39 ; 44,24 WWAN1.4 ; PCIE2.2 59.4,39 ; 44,7 WWAN1.72 ; 44,7.5 WWAN1.70 ; 71.2,39 PCIE1.52 ; PCIE2.24 47.4,39 ; 36.2,39 PCIE2.52
  Bottom Layer w0.508: F1.1 v1(99,18.5) v1(99,27.5) v1(98.5,28) ; GE_WAN.14 7.48,23 18.5,23 23,27.5 42.5,27.5 44,26 44,24.5 ; v1(85,86) 85,90.25 v1(88.75,94) ; 36.2,39 59.4,39 59.9,38.5 62.5,38.5 64.5,40.5 C23.1 ; 94.4,39 67.5,39
  Bottom Layer w1.016: 44,24.5 v1(44,23) v1(44,22) v1(44,21) 44,6.5
  Bottom Layer w1.27: v1(44,22) 63.5,22 65.5,24 65.5,28 ; C23.1 66,40.5 67.5,39 67.5,36.5 67,36 C22.1 65.5,28 ; 96.53,28 65.5,28
  Bottom Layer w2.54: 98.43,27.98 TTL1.1
  vias: v1(98,28.5) v1(99,28.5)
5V: length 98.1
  Top Layer w0.508: v1(31,40.25) 31,44 v1(33.5,46.5) ; F3.1 40,74.5 41.48,73.02 v1(49.25,73.02)
  Bottom Layer w0.508: v1(49.25,73.02) 49.25,64.62 54.36,59.51 ; 54.36,59.51 58.62,55.25 R30.1 R29.1 ; 54.36,59.51 41.35,46.5 v1(33.5,46.5) ; R32.1 R33.1 30.5,40.25 v1(31,40.25)
  Bottom Layer w0.762: v1(49.25,73.02) R20.2
12V: length 86
  Top Layer w0.254: R2.1 42.05,95
  Top Layer w0.381: U2.2 80.7,93.9 C7.1
  Top Layer w2.54: 73,96 73.5,95.5 76.5,95.5 ; 72.75,96 C3.1 70.75,98 46,98 42.52,94.52 42.52,89.48 ; Q3.2 29.71,89.5 42.5,89.5 42.52,89.48 ; 42.52,89.48 45,87 FH1.2
  Bottom Layer w1.27: 53.23,98.5 70.25,98.5 C3.1
12V_SIG: length 6.7
  Top Layer w0.254: R5.1 35.13,96.13 D1.1
  Bottom Layer w0.254: C1.1 36,96.8 R5.1
GND: length 39
  Top Layer w0.254: SIM1.C5 17.04,13.97 C25.2 ; U4.7 23,86.5 19,86.5 18.5,86 18.5,83.54 CAR_IN.3 ; U6.2 v1(20.72,14)
  Top Layer w0.381: U2.4 80.8,92.6 C7.2 ; C14.1 82.3,94.81 U2.1
  Bottom Layer w0.254: U1.4 24.41,86.09 22.5,88 22.5,94.5 23.18,95.18 25.32,95.18 25.5,95 Q1.2
  Bottom Layer w0.508: v1(52.76,92.88) v1(52.01,92.88) v1(51.24,92.88) 51.17,92.96 U3.1
  vias: v1(2,78.5) v1(3,78.5) v1(4,78.5) v1(5,78.5) v1(5.36,90.36) v1(5.36,60.36) v1(5.36,50.36) v1(5.36,45.36) v1(5.36,20.36) v1(5.36,15.36) v1(5.36,10.36) v1(6,78.5) v1(7,78.5) v1(8,78.5) v1(9,78.5) v1(9,70) v1(10,70) v1(10.36,60.36) v1(10.36,25.36) v1(10.36,20.36) v1(10.36,15.36) v1(10.36,10.36) v1(10.36,5.36) v1(11,70) v1(12,70) v1(15,78.5) v1(15.36,75.36) v1(15.36,59.86) v1(15.36,10.36) v1(15.36,5.36) v1(16,78.5) v1(17,78.5) v1(20.36,59.86) v1(20.36,45.36) v1(20.36,40.36) v1(20.36,10.36) v1(20.36,5.36) v1(21.5,67) v1(21.5,54) v1(21.5,49) v1(21.5,35.5) v1(21.5,31) v1(22,24) v1(22.5,71.5) v1(22.8,86.3) v1(23,81) v1(24,81) v1(25,81) v1(25,25) v1(25,11) v1(25.36,59.86) v1(25.36,45.36) v1(25.36,40.36) v1(25.75,17.25) v1(25.75,15.75) v1(26,81) v1(26,22) v1(26.5,68) v1(28.5,12) v1(28.5,10) v1(30.36,45.36) v1(30.36,19.86) v1(30.36,5.36) v1(31.5,11) v1(32,98) v1(32.5,99) v1(33,98) v1(33.5,99) v1(33.5,39.5) v1(33.5,35.79) v1(34,98) v1(34.5,99) v1(35.36,50.36) v1(35.36,45.36) v1(35.36,19.86) v1(35.5,33.5) v1(35.5,30.5) v1(35.5,28.5) v1(35.86,72.86) v1(36.5,70) v1(36.5,67.5) v1(36.5,65) v1(36.5,62.5) v1(36.5,58.5) v1(36.5,56) v1(36.5,53.5) v1(37,42.5) v1(37.5,25.5) v1(38,98.5) v1(38,92.5) v1(39.5,83) v1(39.5,76) v1(39.86,79.36) v1(40.36,25.36) v1(40.5,76) v1(41,83) v1(41,77) v1(41,42.5) v1(41,37.5) v1(41,34.5) v1(42,77) v1(42.5,83) v1(42.7,15.3) v1(42.7,12.9) v1(42.7,10.4) v1(42.7,8.2) v1(43,77) v1(43.5,42.5) v1(43.5,37.5) v1(43.5,34.5) v1(43.5,28.5) v1(44,83) v1(44,77) v1(44,65.5) v1(44,64) v1(44.5,71.5) v1(44.5,70.5) v1(44.86,55.36) v1(44.86,45.86) v1(45.36,79.36) v1(45.36,5.36) v1(45.5,71.5) v1(45.5,70.5) v1(46,12.91) v1(46,10.4) v1(46,8.2) v1(46.36,15.36) v1(46.5,71.5) v1(46.5,70.5) v1(46.86,93.16) v1(46.86,92.36) v1(47,29.7) v1(47.5,71.5) v1(47.5,70.5) v1(47.5,34.5) v1(48,65.5) v1(48.3,29.2) v1(48.5,34.5) v1(50.36,70.36) v1(50.36,65.36) v1(50.36,60.36) v1(50.36,45.36) v1(50.36,19.86) v1(50.36,5.36) v1(50.5,77) v1(50.86,80.36) v1(51,23.5) v1(51.3,29.1) v1(51.5,83) v1(52.5,83) v1(52.5,73) v1(53.5,83) v1(53.5,29.1) v1(53.9,16.3) v1(54.5,83) v1(55.36,80.36) v1(55.36,70.36) v1(55.36,65.36) v1(55.36,55.36) v1(55.36,45.36) v1(55.36,35.36) v1(55.36,10.36) v1(55.36,5.36) v1(55.5,14.8) v1(57.1,13.3) v1(60.36,80.36) v1(60.36,65.36) v1(60.36,60.36) v1(60.36,45.36) v1(60.36,19.86) v1(60.36,17.76) v1(60.36,15.36) v1(60.36,10.36) v1(60.36,5.36) v1(60.86,40.36) v1(62.5,37) v1(62.5,36) v1(62.5,23.5) v1(63.5,37) v1(63.5,36) v1(63.9,29.1) v1(65.36,70.36) v1(65.36,65.36) v1(65.36,60.36) v1(65.36,15.36) v1(65.36,10.36) v1(65.36,5.36) v1(67,23.5) v1(68.86,53.86) v1(69,37.5) v1(69,36.5) v1(69,35.5) v1(69.86,40.36) v1(70.36,90.36) v1(70.36,80.36) v1(70.36,70.36) v1(70.36,65.36) v1(70.36,60.36) v1(70.36,50.36) v1(70.36,15.36) v1(70.36,10.36) v1(70.36,5.36) v1(72,20) v1(74,18.5) v1(74.5,92.5) v1(74.5,91.5) v1(74.5,90.5) v1(74.5,43.5) v1(75.36,80.36) v1(75.36,70.36) v1(75.36,65.36) v1(75.36,15.36) v1(75.36,10.36) v1(75.36,5.36) v1(75.5,99) v1(75.5,92.5) v1(75.5,91.5) v1(75.5,90.5) v1(75.69,23.5) v1(76,17) v1(76.5,92.5) v1(76.5,91.5) v1(76.5,90.5) v1(78.5,43.5) v1(78.5,23.5) v1(79,82) v1(79,81) v1(80,82) v1(80,81) v1(80.36,70.36) v1(80.36,65.36) v1(80.36,60.36) v1(80.36,10.36) v1(80.36,5.36) v1(80.5,48.5) v1(81,23.5) v1(81.5,99) v1(81.5,98) v1(82.5,99) v1(82.5,98) v1(83.5,99) v1(83.5,98) v1(84.5,99) v1(84.5,98) v1(85.36,70.36) v1(85.36,65.36) v1(85.36,60.36) v1(85.36,55.36) v1(85.36,45.36) v1(85.36,15.36) v1(85.36,10.36) v1(85.36,5.36) v1(86.5,36.1) v1(86.5,33.5) v1(86.47,30.75) v1(87,26.5) v1(87.5,79) v1(88.5,79) v1(89.5,79) v1(89.86,10.36) v1(90.36,95.36) v1(90.36,45.36) v1(90.36,5.36) v1(90.5,79) v1(91.5,79) v1(92.5,79) v1(92.5,35) v1(92.5,30) v1(93,70.5) v1(93,65.5) v1(93,60.5) v1(93,55.5) v1(95.36,90.36) v1(95.36,80.36) v1(95.5,46) v1(95.5,44.5) v1(95.5,43) v1(95.5,38.5) v1(95.5,34.5)
CAR_12VIN: length 22.3
  Top Layer w0.254: v1(32.7,94.68) 32.22,94.68 31.34,95.56 26.5,95.56 25.73,96.33 Q3.3
  Bottom Layer w0.254: R11.1 30.5,95.35 R4.1 31.75,94.25 32.18,94.68 v1(32.7,94.68) ; U1.8 20.5,90.2 20.5,95 21,95.5 v1(21.5,95.5)
  Bottom Layer w2.032: D3.1 15.2,94.55 C2.1
CAR_ACC: length 19.3
  Bottom Layer w0.254: R8.1 19,91.75 19,84.6 D5.1 ; R3.2 26,83.75 R26.1 27.8,81.95 C4.2
  Bottom Layer w0.508: R3.2 25.95,83.7 D6.1 20.1,83.7 D5.1
ESW_P1_A_TXV+: length 24.8
  Top Layer w0.254: CORE1.36 37.96,72.09 37.53,71.66 35.43,71.66 34.09,73 18.55,73 18,73.55 GE_LAN1.P2
ESW_P1_A_TXV-: length 24.8
  Top Layer w0.254: GE_LAN1.P3 18.31,72.59 20,72.59 20.18,72.41 20.18,72.24 20.36,72.06 21.52,72.06 21.7,72.24 21.7,72.41 21.88,72.59 23.05,72.59 23.23,72.41 23.23,72.24 23.41,72.06 24.57,72.06 24.75,72.24 24.75,72.41 24.93,72.59 26.1,72.59 26.28,72.41 26.28,72.24 26.45,72.06 27.62,72.06 27.8,72.24 27.8,72.41 27.98,72.59 29.14,72.59 29.32,72.41 29.32,72.24 29.5,72.06 30.67,72.06 30.85,72.24 30.85,72.41 31.03,72.59 33.92,72.59 35.26,71.25 37.53,71.25 37.96,70.82 CORE1.37
ESW_P1_B_TXV+: length 24.8
  Top Layer w0.254: GE_LAN1.P4 18,71.01 18.89,70.12 32.88,70.12 33.88,69.12 37.53,69.12 37.96,69.55 CORE1.38
ESW_P1_B_TXV-: length 24.9
  Top Layer w0.254: GE_LAN1.P7 20.51,69.71 21.24,69.71 21.42,69.53 21.42,69.45 21.6,69.27 22.76,69.27 22.94,69.45 22.94,69.53 23.12,69.71 24.29,69.71 24.47,69.53 24.47,69.45 24.65,69.27 25.81,69.27 25.99,69.45 25.99,69.53 26.17,69.71 27.34,69.71 27.52,69.53 27.52,69.45 27.69,69.27 28.86,69.27 29.04,69.45 29.04,69.53 29.22,69.71 30.38,69.71 30.56,69.53 30.56,69.45 30.74,69.27 31.91,69.27 32.09,69.45 32.09,69.53 32.27,69.71 32.71,69.71 33.71,68.71 37.53,68.71 37.96,68.28 CORE1.39
ESW_P1_C_TXV+: length 25.6
  Top Layer w0.254: v1(28.5,66.76) 29.06,66.76 29.24,66.58 37.53,66.58 37.96,67.01 CORE1.40
  Bottom Layer w0.254: v1(28.5,66.76) 27.94,66.76 27.76,66.58 25.42,66.58 24.46,67.54 24.46,67.79 24.89,68.22 24.89,68.48 24.07,69.3 23.81,69.3 23.38,68.87 23.13,68.87 22.5,69.5 21.29,69.5 21.11,69.68 21.11,70.13 20.93,70.31 19.76,70.31 19.58,70.13 19.58,69.68 19.41,69.5 18.03,69.5 GE_LAN1.P5
ESW_P1_C_TXV-: length 25.7
  Top Layer w0.254: v1(28.5,65.99) 29.06,65.99 29.24,66.17 37.53,66.17 37.96,65.74 CORE1.41
  Bottom Layer w0.254: v1(28.5,65.99) 27.94,65.99 27.76,66.17 25.25,66.17 22.33,69.09 18.82,69.09 18.2,68.47 GE_LAN1.P6
ESW_P1_D_TXV+: length 24.8
  Top Layer w0.254: GE_LAN1.P8 18,65.93 18.52,65.41 22.67,65.41 24.04,64.04 37.53,64.04 37.96,64.47 CORE1.42
ESW_P1_D_TXV-: length 24.9
  Top Layer w0.254: GE_LAN1.P9 18.33,65 22.5,65 23.87,63.63 24.3,63.63 24.47,63.45 24.47,63.27 24.65,63.09 25.82,63.09 26,63.27 26,63.45 26.18,63.63 27.34,63.63 27.52,63.45 27.52,63.27 27.7,63.09 28.87,63.09 29.05,63.27 29.05,63.45 29.23,63.63 30.39,63.63 30.57,63.45 30.57,63.27 30.75,63.09 31.92,63.09 32.09,63.27 32.09,63.45 32.27,63.63 33.44,63.63 33.62,63.45 33.62,63.27 33.8,63.09 34.96,63.09 35.14,63.27 35.14,63.45 35.32,63.63 37.53,63.63 37.96,63.2 CORE1.43
ESW_P2_A_TXV+: length 26.1
  Top Layer w0.254: GE_LAN2.P2 15.5,55.41 22.33,55.41 27.15,60.23 37.53,60.23 37.96,60.66 CORE1.45
ESW_P2_A_TXV-: length 26.1
  Top Layer w0.254: GE_LAN2.P3 18.72,55 22.5,55 22.85,55.35 23.1,55.35 23.4,55.05 23.65,55.05 24.48,55.87 24.48,56.13 24.18,56.42 24.18,56.68 25,57.5 25.26,57.5 25.56,57.2 25.81,57.2 26.63,58.03 26.63,58.28 26.33,58.58 26.33,58.83 27.32,59.82 37.53,59.82 37.96,59.39 CORE1.46
ESW_P2_B_TXV+: length 26.5
  Top Layer w0.254: GE_LAN2.P4 18,53.01 18.6,52.41 23.33,52.41 28.61,57.69 37.53,57.69 37.96,58.12 CORE1.47
ESW_P2_B_TXV-: length 26.5
  Top Layer w0.254: CORE1.48 37.96,56.85 37.53,57.28 28.78,57.28 27.59,56.09 27.59,55.84 27.77,55.66 27.77,55.41 26.95,54.58 26.69,54.58 26.52,54.76 26.26,54.76 25.44,53.94 25.44,53.68 25.62,53.5 25.62,53.25 24.79,52.43 24.54,52.43 24.36,52.61 24.11,52.61 23.5,52 20.8,52 GE_LAN2.P7
ESW_P2_C_TXV+: length 26
  Top Layer w0.254: CORE1.49 37.96,55.58 37.53,55.15 30.57,55.15 28.73,53.31 28.48,53.31 v1(28.09,52.91)
  Bottom Layer w0.254: v1(28.09,52.91) 27.69,52.52 27.69,52.27 26.33,50.91 24.52,50.91 24.34,51.09 24.34,51.5 24.16,51.68 23,51.68 22.82,51.5 22.82,51.09 22.64,50.91 21.47,50.91 21.3,51.09 21.3,51.5 21.12,51.68 19.95,51.68 19.77,51.5 19.77,51.09 19.59,50.91 18.63,50.91 GE_LAN2.P5
ESW_P2_C_TXV-: length 26
  Top Layer w0.254: CORE1.50 37.96,54.31 37.53,54.74 30.74,54.74 29.02,53.02 29.02,52.77 v1(28.63,52.37)
  Bottom Layer w0.254: v1(28.63,52.37) 28.23,51.98 27.98,51.98 26.5,50.5 15.39,50.5 GE_LAN2.P6
ESW_P2_D_TXV+: length 26.4
  Top Layer w0.254: GE_LAN2.P8 18,47.93 18.52,47.41 26.83,47.41 32.03,52.61 37.53,52.61 37.96,53.04 CORE1.51
ESW_P2_D_TXV-: length 26.4
  Top Layer w0.254: CORE1.52 37.96,51.77 37.53,52.2 32.2,52.2 29,49 29,48.75 29.22,48.53 29.22,48.27 28.4,47.45 28.14,47.45 27.92,47.67 27.67,47.67 27,47 24.8,47 24.62,46.82 24.62,46.56 24.44,46.38 23.28,46.38 23.1,46.56 23.1,46.82 22.92,47 21.75,47 21.57,46.82 21.57,46.56 21.39,46.38 20.23,46.38 20.05,46.56 20.05,46.82 19.87,47 18.33,47 GE_LAN2.P9
ESW_P4_A_TXV+: length 24.9
  Top Layer w0.254: 15.36,37.55 15.5,37.41 21.83,37.41 22.83,38.41 36.17,38.41 37.21,37.37 37.53,37.37 37.96,37.8 CORE1.63
ESW_P4_A_TXV-: length 24.9
  Top Layer w0.254: GE_WAN.P3 18.72,37 22,37 23,38 23.5,38 23.68,37.82 23.68,37.59 23.86,37.41 25.02,37.41 25.2,37.59 25.2,37.82 25.38,38 26.54,38 26.72,37.82 26.72,37.59 26.9,37.41 28.07,37.41 28.25,37.59 28.25,37.82 28.43,38 29.59,38 29.77,37.82 29.77,37.59 29.95,37.41 31.12,37.41 31.3,37.59 31.3,37.82 31.48,38 36,38 37.04,36.96 37.53,36.96 37.96,36.53 CORE1.64
ESW_P4_B_TXV+: length 24.8
  Top Layer w0.254: 15.36,35.01 18,35.01 19.01,34 23,34 23.83,34.83 37.53,34.83 37.96,35.26 CORE1.65
ESW_P4_B_TXV-: length 24.8
  Top Layer w0.254: GE_WAN.P7 20.39,33.59 23.17,33.59 24,34.42 24.98,34.42 25.16,34.24 25.16,34.06 25.34,33.88 26.51,33.88 26.69,34.06 26.69,34.24 26.86,34.42 28.03,34.42 28.21,34.24 28.21,34.06 28.39,33.88 29.55,33.88 29.73,34.06 29.73,34.24 29.91,34.42 31.08,34.42 31.26,34.24 31.26,34.06 31.44,33.88 32.6,33.88 32.78,34.06 32.78,34.24 32.96,34.42 37.53,34.42 37.96,33.99 CORE1.66
ESW_P4_C_TXV+: length 24.6
  Top Layer w0.254: v1(28.5,32.47) 29.06,32.47 29.24,32.29 37.53,32.29 37.96,32.72 CORE1.67
  Bottom Layer w0.254: GE_WAN.P5 18.42,33.12 19.28,33.12 19.46,33.3 19.46,33.76 19.64,33.94 20.81,33.94 20.99,33.76 20.99,33.3 21.17,33.12 22.33,33.12 22.51,33.3 22.51,33.76 22.69,33.94 23.86,33.94 24.04,33.76 24.04,33.3 24.22,33.12 24.38,33.12 25.21,32.29 27.76,32.29 27.94,32.47 v1(28.5,32.47)
ESW_P4_C_TXV-: length 24.6
  Top Layer w0.254: v1(28.5,31.7) 29.06,31.7 29.24,31.88 37.53,31.88 37.96,31.45 CORE1.68
  Bottom Layer w0.254: v1(28.5,31.7) 27.94,31.7 27.76,31.88 25.04,31.88 24.21,32.71 18.44,32.71 18.2,32.47 15.36,32.47
ESW_P4_D_TXV+: length 24.2
  Top Layer w0.254: CORE1.69 37.96,30.18 37.53,29.75 16.36,29.75 16.06,30.05 15.47,30.05 15.36,29.93
ESW_P4_D_TXV-: length 24.2
  Top Layer w0.254: GE_WAN.P9 18.68,29.34 20.3,29.34 20.48,29.16 20.48,29.01 20.66,28.83 21.82,28.83 22,29.01 22,29.16 22.18,29.34 23.34,29.34 23.52,29.16 23.52,29.01 23.7,28.83 24.87,28.83 25.05,29.01 25.05,29.16 25.23,29.34 26.39,29.34 26.57,29.16 26.57,29.01 26.75,28.83 27.92,28.83 28.1,29.01 28.1,29.16 28.28,29.34 29.44,29.34 29.62,29.16 29.62,29.01 29.8,28.83 30.96,28.83 31.14,29.01 31.14,29.16 31.32,29.34 37.53,29.34 37.96,28.91 CORE1.70
GPIO13: length 92.6
  Top Layer w0.254: v1(44.5,60.5) 46.5,62.5 v1(57,62.5) ; CORE1.121 v1(85.5,47.96)
  Bottom Layer w0.254: v1(57,62.5) 70.96,62.5 v1(85.5,47.96) ; v1(44.5,60.5) 43.86,61.14 14.85,61.14 9,67 R39.2
GPIO14: length 91.8
  Top Layer w0.254: v1(61.6,52.2) 61.8,52 81,52 83.77,49.23 CORE1.122
  Bottom Layer w0.254: v1(61.6,52.2) 61.4,52 50.5,52 46,47.5 46,44.5 45.14,43.64 14.35,43.64 9,49 R41.2
GPIO15: length 95.1
  Top Layer w0.254: v1(61.6,51.3) 61.8,51.5 80.5,51.5 85.31,46.69 CORE1.120
  Bottom Layer w0.254: v1(61.6,51.3) 61.4,51.5 51,51.5 46.5,47 46.5,44.5 45.29,43.29 18.04,43.29 R43.1
GPIO16: length 78.2
  Top Layer w0.254: v1(46,81.5) 56,81.5 v1(59.5,78) ; v1(85.5,52) 85.73,51.77 CORE1.124 93.52,51.77 R27.1
  Bottom Layer w0.254: Q4.3 34,80.5 45,80.5 v1(46,81.5) ; v1(59.5,78) v1(85.5,52)
GPIO17: length 5
  Top Layer w0.254: CORE1.123 R28.1
I2C_SCL: length 144.4
  Top Layer w0.254: 26.5,82.5 29.5,82.5 v1(31,81) ; 26.5,82.5 24,82.5 23.5,83 U4.5 ; 26.5,82.5 U5.3 ; 70.36,22.54 72.04,22.54 74.16,24.66 CORE1.96 ; 70.36,22.54 v1(70.28,22.62) ; 70.36,22.54 49.96,22.54 v1(49,23.5) ; 92.75,10 96.36,10 I2C_1.4 ; v1(48.58,38) v1(48.58,58)
  Bottom Layer w0.254: v1(48.58,38) 52.5,34.08 52.5,26 51.5,25 50,25 49,24 v1(49,23.5) ; v1(70.28,22.62) 70.14,22.48 70.14,18.66 76.8,12 94.74,12 I2C_1.4 ; v1(31,81) 31,80.83 48.58,63.24 v1(48.58,58)
I2C_SDA: length 150.5
  Top Layer w0.254: v1(48,23.5) 49.55,21.96 v1(71.04,21.96) 72.13,21.96 75.48,25.3 75.48,25.66 CORE1.97 ; U5.4 29.5,83.5 32,81 32,80.75 31.25,80 v1(31,80) 29,82 23.5,82 23,82.5 U4.4 ; I2C_1.3 95.32,11.5 92.75,11.5 ; v1(48,57) v1(48,37.5)
  Bottom Layer w0.254: v1(48,57) 48,63 v1(31,80) ; v1(48,37.5) 52,33.5 52,26.5 51,25.5 49.5,25.5 48,24 v1(48,23.5) ; v1(71.04,21.96) 70.6,21.51 70.6,18.9 77.02,12.48 96.3,12.48 I2C_1.3
LED_P1: length 79.5
  Top Layer w0.254: CORE1.74 v1(46.22,60)
  Bottom Layer w0.254: R40.2 5.75,70.75 15,61.5 44.72,61.5 v1(46.22,60)
LED_P2: length 62.1
  Top Layer w0.254: CORE1.73 v1(44.95,44.5)
  Bottom Layer w0.254: R42.2 5.75,52.75 14.5,44 44.45,44 v1(44.95,44.5)
LED_P4: length 44.9
  Top Layer w0.254: CORE1.71 41.2,24.5 36.5,24.5 32.94,20.94 23.56,20.94 21.15,23.36 16.65,23.36 8.65,31.36 8.64,31.36 v1(6.5,33.5)
  Bottom Layer w0.254: R44.2 5.75,34.25 v1(6.5,33.5)
PCIE0_REFCLK+: length 15.1
  Top Layer w0.254: CORE1.117 90.04,42.88 90.47,43.31 91.19,43.31 91.5,43 91.5,41.73 91.32,41.55 91.11,41.55 90.93,41.37 90.93,40.21 91.11,40.03 91.32,40.03 91.5,39.85 91.5,38.74 91.32,38.56 v1(91.32,38)
  Bottom Layer w0.254: v1(91.32,38) 91.32,37.44 91.5,37.26 91.5,36.5 90.2,35.2 90.2,33.85 90,33.65 PCIE1.13
PCIE0_REFCLK-: length 15.1
  Top Layer w0.254: CORE1.118 90.04,44.15 90.47,43.72 91.36,43.72 91.91,43.17 91.91,38.74 92.08,38.56 v1(92.08,38)
  Bottom Layer w0.254: PCIE1.11 90.8,33.65 90.6,33.85 90.6,35.03 91.91,36.33 91.91,37.26 92.08,37.44 v1(92.08,38)
PCIE0_RX+: length 12.1
  Top Layer w0.254: CORE1.114 87.53,39.07 87.1,38.64 84.18,38.64 82.2,36.66 82.2,36.24 82.02,36.06 v1(82.02,35.5)
  Bottom Layer w0.254: PCIE1.25 82,33.65 82.2,33.85 82.2,34.76 82.02,34.94 v1(82.02,35.5)
PCIE0_RX-: length 12.1
  Top Layer w0.254: v1(82.78,35.5) 82.78,36.06 82.6,36.24 82.6,36.49 82.91,36.8 83.17,36.8 83.3,36.67 83.55,36.67 84.38,37.49 84.38,37.74 84.24,37.88 84.24,38.13 84.34,38.23 87.1,38.23 87.53,37.8 CORE1.113
  Bottom Layer w0.254: PCIE1.23 82.8,33.65 82.6,33.85 82.6,34.76 82.78,34.94 v1(82.78,35.5)
PCIE0_TX+: length 16.3
  Top Layer w0.254: CORE1.116 87.53,41.61 87.1,41.18 83.52,41.18 79,36.66 79,36.24 78.82,36.06 v1(78.82,35.5)
  Bottom Layer w0.254: PCIE1.33 78.8,33.65 79,33.85 79,34.76 78.82,34.94 v1(78.82,35.5)
PCIE0_TX-: length 16.3
  Top Layer w0.254: v1(79.58,35.5) 79.58,36.06 79.4,36.24 79.4,36.49 80.88,37.97 81.14,37.97 81.27,37.84 81.53,37.84 82.35,38.66 82.35,38.92 82.22,39.05 82.22,39.31 83.68,40.77 87.1,40.77 87.53,40.34 CORE1.115
  Bottom Layer w0.254: PCIE1.31 79.6,33.65 79.4,33.85 79.4,34.76 79.58,34.94 v1(79.58,35.5)
PCIE1_REFCLK+: length 38.7
  Top Layer w0.254: v1(58,35.58) 58.56,35.58 58.74,35.41 61.17,35.41 64.29,32.29 82.21,32.29 84.75,34.83 87.1,34.83 87.53,35.26 CORE1.111
  Bottom Layer w0.254: v1(58,35.58) 57.44,35.58 57.26,35.41 56.33,35.41 55.2,34.27 55.2,33.85 55,33.65 PCIE2.13
PCIE1_REFCLK-: length 38.7
  Top Layer w0.254: v1(58,34.82) 58.56,34.82 58.74,35 61,35 61.5,34.5 61.5,34.25 61.35,34.1 61.35,33.85 62.18,33.02 62.43,33.02 62.58,33.17 62.83,33.17 64.12,31.88 82.38,31.88 84.92,34.42 87.1,34.42 87.53,33.99 CORE1.110
  Bottom Layer w0.254: PCIE2.11 55.8,33.65 55.6,33.85 55.6,34.1 56.5,35 57.26,35 57.44,34.82 v1(58,34.82)
PCIE1_RX+: length 44.9
  Top Layer w0.254: v1(50.5,29.82) 51.06,29.82 51.24,30 83,30 84.88,31.88 87.1,31.88 87.53,31.45 CORE1.108
  Bottom Layer w0.254: PCIE2.25 47,31.15 47.2,30.95 47.2,30.53 47.72,30 49.76,30 49.94,29.82 v1(50.5,29.82)
PCIE1_RX-: length 44.8
  Top Layer w0.254: CORE1.109 87.53,32.72 87.1,32.29 84.71,32.29 82.83,30.41 59.49,30.41 59.23,30.66 57.96,30.66 57.71,30.41 56.44,30.41 56.18,30.66 54.91,30.66 54.66,30.41 53.39,30.41 53.14,30.66 51.87,30.66 51.61,30.41 51.24,30.41 51.06,30.58 v1(50.5,30.58)
  Bottom Layer w0.254: v1(50.5,30.58) 49.94,30.58 49.76,30.41 47.89,30.41 47.6,30.7 47.6,30.95 47.8,31.15 PCIE2.23
PCIE1_TX+: length 49.4
  Top Layer w0.254: CORE1.106 87.53,28.91 87.1,29.34 85,29.34 83.66,28 50.24,28 50.06,27.82 v1(49.5,27.82)
  Bottom Layer w0.254: PCIE2.33 43.8,31.15 44,30.95 44,29.34 45.33,28 48.76,28 48.94,27.82 v1(49.5,27.82)
PCIE1_TX-: length 49.4
  Top Layer w0.254: CORE1.107 87.53,30.18 87.1,29.75 84.83,29.75 83.49,28.41 50.24,28.41 50.06,28.58 v1(49.5,28.58)
  Bottom Layer w0.254: v1(49.5,28.58) 48.94,28.58 48.76,28.41 47.76,28.41 47.59,28.59 47.59,28.77 47.41,28.95 46.24,28.95 46.06,28.77 46.06,28.59 45.88,28.41 45.5,28.41 44.4,29.5 44.4,30.95 44.6,31.15 PCIE2.31
PCIE2_REFCLK+: length 62.6
  Top Layer w0.254: v1(58,11.12) 58.56,11.12 58.74,11.3 80.37,11.3 82.62,13.54 82.62,24.03 83.05,24.46 CORE1.103 ; v1(36.5,11.12) 37.06,11.12 37.24,11.3 46.76,11.3 46.94,11.12 v1(47.5,11.12)
  Bottom Layer w0.254: v1(47.5,11.12) 48.06,11.12 48.24,11.3 57.26,11.3 57.44,11.12 v1(58,11.12) ; v1(36.5,11.12) 35.94,11.12 35.76,11.3 34.3,11.3 34.25,11.25 WWAN1.55
PCIE2_REFCLK-: length 62.7
  Top Layer w0.254: CORE1.102 81.78,24.46 82.21,24.03 82.21,13.71 80.2,11.7 74.73,11.7 74.55,11.88 74.55,11.91 74.37,12.09 73.21,12.09 73.03,11.91 73.03,11.88 72.85,11.7 71.68,11.7 71.5,11.88 71.5,11.91 71.32,12.09 70.16,12.09 69.98,11.91 69.98,11.88 69.8,11.7 58.74,11.7 58.56,11.88 v1(58,11.88) ; v1(47.5,11.88) 46.94,11.88 46.76,11.7 37.24,11.7 37.06,11.88 v1(36.5,11.88)
  Bottom Layer w0.254: v1(58,11.88) 57.44,11.88 57.26,11.7 48.24,11.7 48.06,11.88 v1(47.5,11.88) ; WWAN1.53 34.25,11.75 34.3,11.7 35.76,11.7 35.94,11.88 v1(36.5,11.88)
PCIE2_RX+: length 75.1
  Top Layer w0.254: CORE1.100 79.24,24.46 79.67,24.03 79.67,22.67 74,17 71.44,17 71.26,17.18 71.26,17.22 71.08,17.4 69.91,17.4 69.73,17.22 69.73,17.18 69.55,17 68.39,17 68.21,17.18 68.21,17.22 68.03,17.4 66.86,17.4 66.68,17.22 66.68,17.18 66.5,17 65.34,17 65.16,17.18 65.16,17.22 64.98,17.4 63.81,17.4 63.64,17.22 63.64,17.18 63.46,17 58.93,17 49.31,7.38 34.59,7.38 34.41,7.56 34.41,7.62 34.23,7.8 33.06,7.8 32.88,7.62 32.88,7.56 32.7,7.38 31.54,7.38 31.36,7.56 31.36,7.62 31.18,7.8 30.01,7.8 29.83,7.62 29.83,7.56 29.65,7.38 29.19,7.38 27.38,9.19 27.38,10.26 27.56,10.44 v1(27.56,11)
  Bottom Layer w0.254: v1(27.56,11) 27.56,11.56 27.38,11.74 27.38,12.38 29.3,14.3 32.15,14.3 32.2,14.25 WWAN1.43
PCIE2_RX-: length 75.1
  Top Layer w0.254: v1(26.8,11) 26.8,10.44 26.97,10.26 26.97,9.03 29.03,6.97 49.47,6.97 59.09,16.59 74.17,16.59 80.08,22.5 80.08,24.03 80.51,24.46 CORE1.101
  Bottom Layer w0.254: WWAN1.41 32.2,14.75 32.15,14.7 29.13,14.7 26.97,12.55 26.97,11.74 26.8,11.56 v1(26.8,11)
PCIE2_TX+: length 63.7
  Top Layer w0.254: v1(30.18,11) 30.18,10.44 30,10.26 30,10.01 30.51,9.5 30.94,9.5 31.12,9.68 31.12,9.76 31.3,9.94 32.47,9.94 32.65,9.76 32.65,9.68 32.83,9.5 33.99,9.5 34.17,9.68 34.17,9.76 34.35,9.94 35.52,9.94 35.7,9.76 35.7,9.68 35.88,9.5 48.43,9.5 57.83,18.91 63.45,18.91 63.63,19.09 63.63,19.12 63.81,19.3 64.98,19.3 65.16,19.12 65.16,19.09 65.34,18.91 66.5,18.91 66.68,19.09 66.68,19.12 66.86,19.3 68.03,19.3 68.2,19.12 68.2,19.09 68.38,18.91 69.55,18.91 69.73,19.09 69.73,19.12 69.91,19.3 71.07,19.3 71.25,19.12 71.25,19.09 71.43,18.91 72.33,18.91 77.13,23.71 77.13,24.03 76.7,24.46 CORE1.98
  Bottom Layer w0.254: WWAN1.49 32.7,12.75 32.65,12.8 30.8,12.8 30,12 30,11.74 30.18,11.56 v1(30.18,11)
PCIE2_TX-: length 63.6
  Top Layer w0.254: v1(29.42,11) 29.42,10.44 29.59,10.26 29.59,9.84 30.34,9.09 48.59,9.09 58,18.5 72.5,18.5 77.54,23.54 77.54,24.03 77.97,24.46 CORE1.99
  Bottom Layer w0.254: WWAN1.47 32.7,13.25 32.65,13.2 30.63,13.2 29.59,12.17 29.59,11.74 29.42,11.56 v1(29.42,11)
PERST: length 102.4
  Top Layer w0.254: v1(92.5,46.5) 93.5,45.5 93.5,29.5 89.71,25.71 CORE1.105 85.59,21.09 v1(85.5,21) ; v1(72,21) 53.75,21 R36.2
  Bottom Layer w0.254: R34.2 R31.2 92.25,46.75 v1(92.5,46.5) ; v1(72,21) v1(85.5,21)
RST_BTN: length 6
  Top Layer w0.254: CORE1.112 89.47,36.53 92.5,33.5 TP2.1
SENSE_V+: length 2.8
  Top Layer w0.254: R1.2 21.5,89.52 U4.10
SENSE_V-: length 21.3
  Top Layer w0.254: U4.9 22,89.5 23,90.5 23.48,90.5 22.5,89.52 U4.8 ; D2.3 20.1,92.81 21.48,92.81 23.7,95.02 31.08,95.02 32.7,93.4 D1.2
SERIAL_RXD1: length 24.7
  Top Layer w0.254: v1(70.32,23.97) 70.35,24 CORE1.93 ; v1(90,19.75) 90,21.25
  Bottom Layer w0.254: v1(70.32,23.97) 70.82,23.97 72.65,22.14 87.6,22.14 v1(90,19.75)
SERIAL_RXD2: length 14
  Top Layer w0.254: CORE1.11 72.89,76.87 72,77.76 66.24,77.76 64.5,79.5 64.5,81 TTL2.3
SERIAL_TXD1: length 28.2
  Top Layer w0.254: v1(71.62,24) CORE1.94
  Bottom Layer w0.254: TTL1.4 94.31,22.6 72.9,22.6 71.62,23.88 v1(71.62,24)
SERIAL_TXD2: length 11.5
  Top Layer w0.254: TTL2.4 65.5,79.5 66.64,78.36 72.15,78.36 74.16,76.34 CORE1.10
UIM_CLK: length 28.4
  Top Layer w0.254: SIM1.C3 15.32,20 20.02,20 C28.1 21.67,18.35 21.67,17.65 22.05,18.03 v1(37.5,18.03)
  Bottom Layer w0.254: v1(37.5,18.03) 38.53,17 WWAN1.32
UIM_DAT: length 28.6
  Top Layer w0.254: 17.16,19.06 18.36,19.06 19.77,17.65 19.77,16.95 20.22,16.5 v1(37.5,16.5) ; 17.16,19.06 17.22,19 R37.1 ; 17.16,19.06 SIM1.C7
  Bottom Layer w0.254: v1(37.5,16.5) WWAN1.34
UIM_DET: length 39.2
  Top Layer w0.254: R38.1 21.67,12.7 U6.3 ; R38.1 22.75,12.25 v1(23,12) ; R38.1 20.95,12.52 15.25,12.52 15,12.78 SIM1.CD
  Bottom Layer w0.254: v1(23,12) 23,8.5 28,3.5 36.5,3.5 37,4 37,6.5 39,8.5 WWAN1.66
UIM_PWR: length 34.6
  Top Layer w0.254: v1(13,15) 14.75,15 SIM1.C1 17.17,15.25 C25.1 17.22,16.75 ; v1(37.5,15) v1(23.5,15)
  Bottom Layer w0.254: WWAN1.36 38.5,16 v1(37.5,15) ; v1(23.5,15) v1(13,15)
UIM_RST: length 32.8
  Top Layer w0.254: C26.2 19.77,13.75 U6.1 19.77,15.85 18.5,17.12 ; v1(37.5,19) v1(23,19) ; 18.5,17.12 18.05,17.57 15.21,17.57 SIM1.C2 ; 18.5,17.12 18.5,17.11 v1(18.5,17)
  Bottom Layer w0.254: WWAN1.30 39,17.5 v1(37.5,19) ; v1(18.5,17) 19,17.5 21.5,17.5 v1(23,19)
USB3_DM: length 18.6
  Top Layer w0.254: L3.3 39.55,77.6 39.75,77.8 45.15,77.8 45.4,77.54 46.67,77.54 46.92,77.8 48.19,77.8 48.45,77.54 49.72,77.54 49.97,77.8 51.24,77.8 51.5,77.54 52.76,77.54 53.02,77.8 54,77.8 54.27,77.53 54.27,76.97 53.84,76.54 CORE1.26
USB3_DP: length 18.6
  Top Layer w0.254: CORE1.25 55.11,76.54 54.68,76.97 54.68,77.69 54.17,78.2 39.75,78.2 39.55,78.4 L3.4
USB_LTE_DM: length 98.3
  Top Layer w0.254: v1(25,22.62) 24.44,22.62 24.26,22.8 23.63,22.8 22.91,23.51 22.91,25.91 24,27 40,27 42,29 42,65.5 44.12,67.62 58.7,67.62 64.43,73.35 64.43,73.6 64,74.03 CORE1.18
  Bottom Layer w0.254: WWAN1.9 32.7,22.75 32.65,22.8 25.74,22.8 25.56,22.62 v1(25,22.62)
USB_LTE_DP: length 98.3
  Top Layer w0.254: v1(25,23.38) 24.44,23.38 24.26,23.2 23.8,23.2 23.32,23.68 23.32,25.75 24.17,26.59 25.04,26.59 25.3,26.34 26.57,26.34 26.82,26.59 28.09,26.59 28.34,26.34 29.61,26.34 29.87,26.59 31.14,26.59 31.39,26.34 32.66,26.34 32.92,26.59 40.17,26.59 42.41,28.83 42.41,65.33 44.29,67.21 58.87,67.21 64.84,73.18 64.84,73.6 65.27,74.03 CORE1.17
  Bottom Layer w0.254: WWAN1.7 32.7,23.25 32.65,23.2 25.74,23.2 25.56,23.38 v1(25,23.38)
USBPORT_DM: length 15.2
  Top Layer w0.254: L3.2 36.45,77.6 36.25,77.8 35.45,77.8 ; U7.3 35.45,77.8 ; 35.45,77.8 32.3,77.8 32.12,77.62 32.12,77.58 31.94,77.4 30.78,77.4 30.6,77.58 30.6,77.62 30.42,77.8 29.25,77.8 29.07,77.62 29.07,77.58 28.89,77.4 27.73,77.4 27.55,77.58 27.55,77.62 27.37,77.8 26.5,77.8 26.2,77.5 26.2,76.55 USB1.2
USBPORT_DP: length 15.1
  Top Layer w0.254: USB1.3 25.8,76.55 25.8,77.67 26.33,78.2 35.45,78.2 ; 35.45,78.2 36.25,78.2 36.45,78.4 L3.1 ; 35.45,78.2 U7.4
$1N5779: length 7.5
  Top Layer w0.508: v1(54.62,91.88) 53.12,90.38 v1(52.12,90.38)
  Bottom Layer w0.508: R17.2 v1(54.62,91.88) 56.37,91.88 R18.2 ; v1(52.12,90.38) U3.5
$1N5780: length 2.4
  Bottom Layer w0.508: R21.2 50.26,90.63 U3.6
$1N5781: length 1.5
  Bottom Layer w0.508: 53.07,91.53 53.07,90.69 R19.2
$1N5784: length 4.4
  Bottom Layer w0.508: R16.2 R19.1 51.01,88.75 R20.1
$1N5786: length 1.5
  Bottom Layer w0.508: 49.12,93.68 R21.1
$1N5787: length 6.2
  Bottom Layer w0.508: U3.2 52.12,94.88 51.76,95.24 47.76,95.24 L2.1
$1N15270: length 9.2
  Top Layer w2.54: 12VOUT1.1 57.52,90.52 54,87 FH1.1
$1N16726: length 1.4
  Top Layer w0.254: R2.2 49.2,95 LED_12V.2
$1N19096: length 8.6
  Bottom Layer w0.254: D7.1 32.11,92.75 R4.2 30.5,92 27.14,88.64 U1.2
$1N19099: length 18.4
  Top Layer w0.254: R6.1 39.75,97.25 37,94.5 R5.2
  Bottom Layer w0.254: U1.3 27.36,87.36 31.5,91.5 33,91.5 R5.2
$1N19100: length 3.4
  Bottom Layer w0.254: R7.1 24,91 25.09,89.91 U1.1
$1N19101: length 2.3
  Bottom Layer w0.254: Q1.1 25.5,91.75 R7.2
$1N23103: length 11.1
  Top Layer w0.254: Q3.1 28.29,97.79 v1(27.5,97)
  Bottom Layer w0.254: R10.2 v1(27.5,97) 28.3,97 C6.2 28.75,96.95 R11.2 29,95.35 R9.1
$1N23613: length 7.3
  Bottom Layer w0.508: CAR_IN.2 16,84.5 20,80.5 D5.2
$1N26662: length 2.5
  Bottom Layer w0.254: Q2.1 18.5,95.55 R8.2
$1N26941: length 1.6
  Bottom Layer w0.254: R9.2 27.75,92.75 Q1.3
$1N26980: length 2.2
  Bottom Layer w0.254: Q2.3 R10.1
$1N27764: length 3.6
  Top Layer w0.381: U2.7 84.21,93.9 83.7,94.41 C14.2
$1N27807: length 11.5
  Top Layer w0.381: U2.6 85.75,93.25 v1(86.5,94)
  Top Layer w0.508: R13.1 79.15,96.5 v1(79.7,96.5) 80.25,96.5 R12.1
  Bottom Layer w0.508: v1(86.5,94) 84,96.5 v1(79.7,96.5)
$1N27948: length 6.8
  Top Layer w0.381: C9.2 86.93,90.73 84.04,90.73 83.77,91 83.77,93.25 U2.3
$1N28127: length 2.2
  Top Layer w0.381: U2.5 86.6,92.6 C9.1
$1N28466: length 5.3
  Top Layer w0.381: R15.2 85.5,95.06 U2.8
  Top Layer w0.508: R15.2 87,96.25 R14.2 87.25,97.45 C13.2
$1N43921: length 1.9
  Top Layer w0.254: D8.1 42.01,98.75 R6.2
$1N46222: length 18.6
  Top Layer w0.254: C21.1 R22.1 20.75,79.75 19.5,81 19.5,85.25 19.75,85.5 23.5,85.5 23.5,86 ; U4.6 23.5,86 ; 23.5,86 25,84.5 U5.2
$2N1163: length 6.6
  Top Layer w0.254: R23.2 96.4,22.75 TTL1.3
$2N2937: length 2.1
  Bottom Layer w0.254: R26.2 28,83.25 Q4.1
$2N3184: length 11.6
  Top Layer w0.508: TTL2.1 68,88.5 73.75,88.5 75,87.25 F2.2
$2N4030: length 3.1
  Bottom Layer w0.508: I2C_1.1 98.11,16.25 99,16.25
$3N1265: length 32.3
  Top Layer w0.508: v1(74.5,36.5) 76,38 v1(76,49)
  Bottom Layer w0.508: PCIE1.49 72.4,34.4 ; 72.4,34.4 71.6,33.6 PCIE1.51 ; 72.4,34.4 v1(74.5,36.5) ; R29.2 72.75,52.25 v1(76,49)
$3N1269: length 35.2
  Top Layer w0.508: v1(76.76,49) 76.76,37.68 v1(75.04,35.96)
  Bottom Layer w0.508: PCIE1.45 74,34.92 ; 74,34.92 v1(75.04,35.96) ; 74,34.92 73.2,34.12 PCIE1.47 ; v1(76.76,49) 76.76,49.24 76.29,49.71 76.29,49.71 69.25,56.75 R30.2
$3N1274: length 14.1
  Bottom Layer w0.508: 36.6,33.8 PCIE2.51 ; 36.6,33.8 37.4,33.8 PCIE2.49 ; 36.6,33.8 36.6,33.9 33.56,36.94 28.51,36.94 28,37.44 28,37.75
$3N1278: length 15.8
  Bottom Layer w0.508: PCIE2.45 39,34.5 38.2,35.3 ; 38.2,35.3 35.75,37.75 29.5,37.75 ; 38.2,35.3 PCIE2.47
